# Altium project MB1144C.PrjPCB (part 1 of 4)
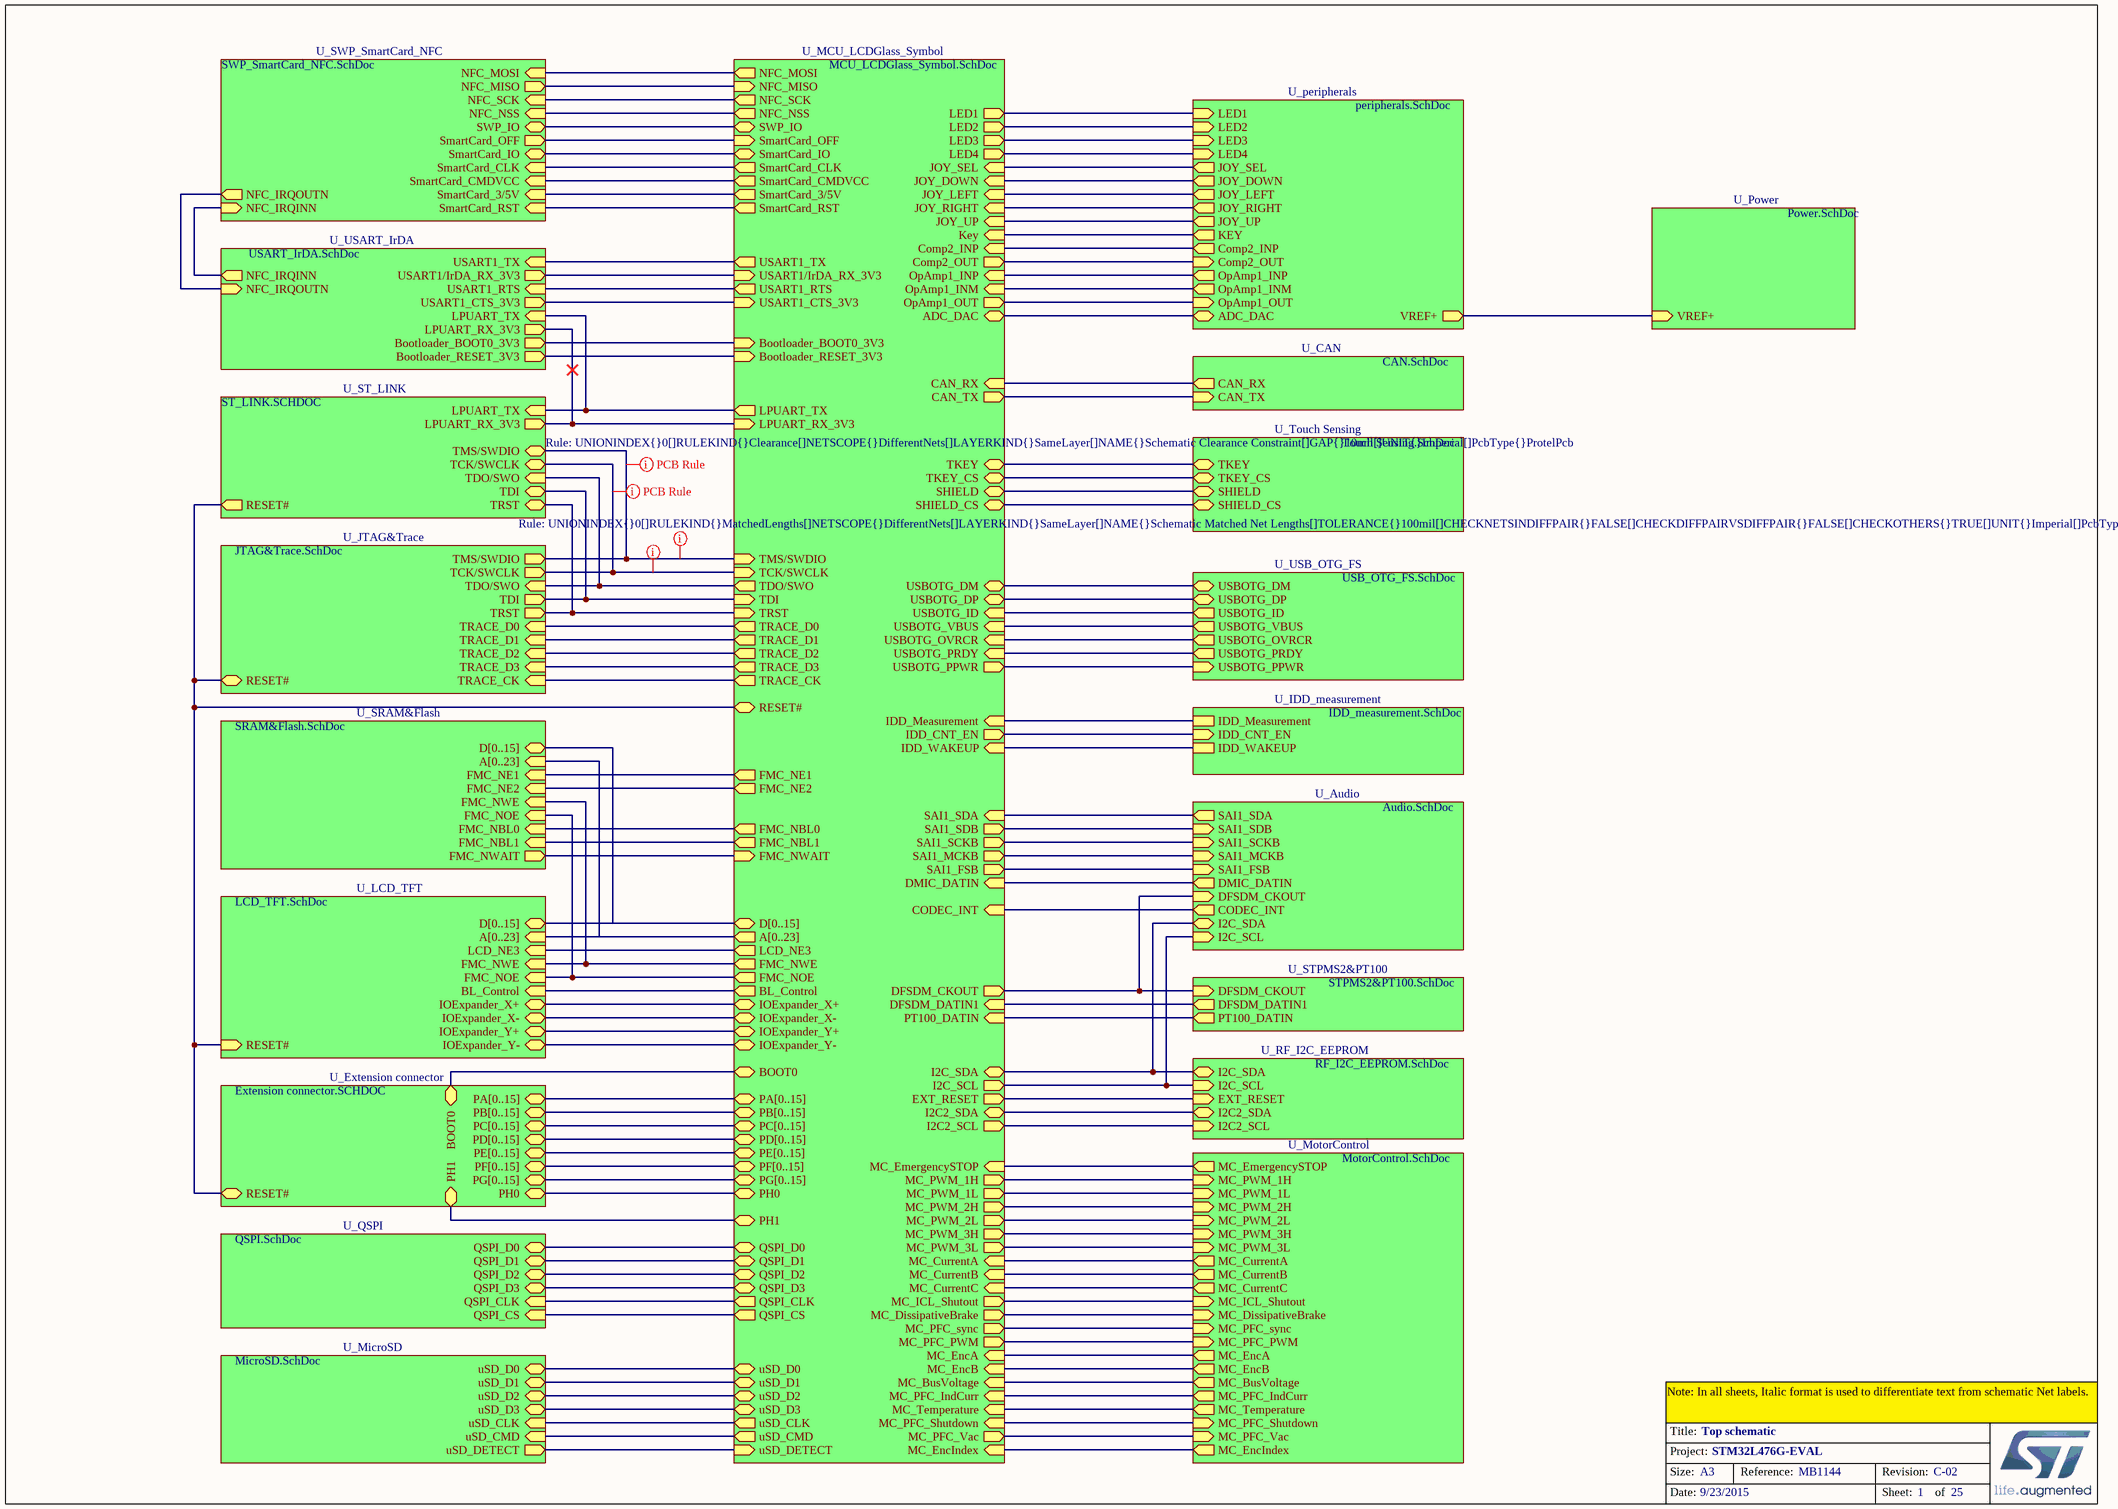
[diagram p0: Top.SchDoc]
25 sheets, 601 parts. Net scope: hierarchical (ports join the sheet entries above them; power ports are global).
Sheets:
  Top.SchDoc
    U_MCU_LCDGlass_Symbol = MCU_LCDGlass_Symbol.SchDoc
      U_MCU = MCU.SchDoc
      U_LCD_Glass = LCD_Glass.SchDoc
      U_IO_Expandor = IO_Expandor.SchDoc
      U_MCU2 = MCU2.SchDoc
    U_SRAM&Flash = SRAM&Flash.SchDoc
    U_MotorControl = MotorControl.SchDoc
    U_MicroSD = MicroSD.SchDoc
    U_QSPI = QSPI.SchDoc
    U_Extension connector = Extension connector.SCHDOC
    U_JTAG&Trace = JTAG&Trace.SchDoc
    U_ST_LINK = ST_LINK.SCHDOC
    U_USART_IrDA = USART_IrDA.SchDoc
    U_SWP_SmartCard_NFC = SWP_SmartCard_NFC.SchDoc
    U_STPMS2&PT100 = STPMS2&PT100.SchDoc
    U_IDD_measurement = IDD_measurement.SchDoc
    U_USB_OTG_FS = USB_OTG_FS.SchDoc
    U_Touch Sensing = Touch Sensing.SchDoc
    U_CAN = CAN.SchDoc
    U_peripherals = peripherals.SchDoc
    U_Power = Power.SchDoc
    U_Audio = Audio.SchDoc
    U_LCD_TFT = LCD_TFT.SchDoc
    U_RF_I2C_EEPROM = RF_I2C_EEPROM.SchDoc

## Sheet Top.SchDoc: Top schematic
size A3; DocumentNumber: MB1144; Revision: C-02; SheetNumber: 1; SheetTotal: 25; PageSetup: Record=PageOptions|CenterHorizontal=True|CenterVertical=True|PrintScale=1.01|XCorrection=1.00|YCorrection=1.00|PrintKind=1|BorderSize=5000000|LeftOffset=0|BottomOffset=0|Orientation=2|PaperLength=1000|PaperWidth=1000|Scale=100|PaperSource=264|PrintQuality=600|MediaType=1|DitherType=10|PaperKind=A3|PrintScaleMode=1; Project: STM32L476G-EVAL; DocumentName: STM32L476G-EVAL; ModifiedDate: 9/23/2015; ProjectName: STM32L476G-EVAL

### Sub-sheets
U_Audio = Audio.SchDoc: SAI1_SCKB (in), SAI1_FSB (in), SAI1_SDB (in), CODEC_INT (out), I2C_SCL (in), SAI1_MCKB (in), I2C_SDA (bidir), DMIC_DATIN (out), DFSDM_CKOUT (in), SAI1_SDA (out)
U_CAN = CAN.SchDoc: CAN_TX (in), CAN_RX (out)
U_Extension connector = Extension connector.SCHDOC: PA[0..15] (bidir), PB[0..15] (bidir), PC[0..15] (bidir), PD[0..15] (bidir), PE[0..15] (bidir), RESET# (bidir), PF[0..15] (bidir), PG[0..15] (bidir), PH1, PH0, BOOT0
U_IDD_measurement = IDD_measurement.SchDoc: IDD_Measurement, IDD_CNT_EN (in), IDD_WAKEUP
U_JTAG&Trace = JTAG&Trace.SchDoc: TDI (out), RESET# (bidir), TRACE_D3 (in), TRACE_D2 (in), TRACE_D1 (in), TRACE_D0 (in), TRACE_CK (in), TRST (out), TMS/SWDIO (out), TCK/SWCLK (out), TDO/SWO (in)
U_LCD_TFT = LCD_TFT.SchDoc: RESET# (in), FMC_NWE (in), LCD_NE3 (in), FMC_NOE (in), D[0..15] (bidir), A[0..23] (in), IOExpander_Y+ (bidir), IOExpander_Y- (bidir), IOExpander_X+ (bidir), IOExpander_X- (bidir), BL_Control (in)
U_MCU_LCDGlass_Symbol = MCU_LCDGlass_Symbol.SchDoc: FMC_NWAIT (in), FMC_NOE (out), FMC_NWE (out), FMC_NE1 (out), FMC_NE2 (out), LCD_NE3 (out), LED1 (out), LED2 (out), LPUART_TX (out), USART1_TX (out), USART1_RTS (out), TMS/SWDIO (in), TCK/SWCLK (in), TDI (in), TRST (in), Key (in), DFSDM_DATIN1 (in), IDD_Measurement (in), CODEC_INT (in), USBOTG_PRDY (in), USBOTG_OVRCR (in), DMIC_DATIN (in), PT100_DATIN (in), USBOTG_VBUS (in), USBOTG_ID (in), IDD_WAKEUP (in), OpAmp1_INM (in), Comp2_INP (in), TDO/SWO (out), TRACE_D1 (out), TRACE_D2 (out), TRACE_D3 (out), IDD_CNT_EN (out), USBOTG_PPWR (out), TRACE_CK (out), TRACE_D0 (out), SmartCard_CLK (out), OpAmp1_OUT (out), ADC_DAC (bidir), USBOTG_DP (bidir), USBOTG_DM (bidir), SmartCard_IO (bidir), QSPI_D0 (bidir), QSPI_D1 (bidir), QSPI_D2 (bidir), QSPI_D3 (bidir), uSD_D0 (bidir), uSD_D1 (bidir), uSD_D2 (bidir), uSD_D3 (bidir), MC_DissipativeBrake (out), MC_PFC_sync (out), MC_PWM_1H (out), MC_PWM_1L (out), MC_PWM_2H (out), MC_PWM_2L (out), MC_PWM_3H (out), MC_PWM_3L (out), MC_ICL_Shutout (out), MC_PFC_PWM (out), MC_PFC_Vac (out), QSPI_CLK (out), QSPI_CS (out), FMC_NBL0 (out), FMC_NBL1 (out), CAN_TX (out), MC_EncA (in), MC_EncB (in), MC_EncIndex (in), MC_CurrentB (in), MC_CurrentC (in), MC_Temperature (in), MC_PFC_Shutdown (in), CAN_RX (in), uSD_DETECT (in), uSD_CMD (out), uSD_CLK (out), SWP_IO (bidir), IOExpander_X+ (bidir), IOExpander_X- (bidir), IOExpander_Y+ (bidir), IOExpander_Y- (bidir), JOY_SEL (in), JOY_DOWN (in), JOY_LEFT (in), JOY_RIGHT (in), JOY_UP (in), SmartCard_OFF (in), LED4 (out), LED3 (out), SmartCard_RST (out), SmartCard_CMDVCC (out), SmartCard_3/5V (out), D[0..15] (bidir), A[0..23] (out), PA[0..15] (bidir), PB[0..15] (bidir), PC[0..15] (bidir), PD[0..15] (bidir), PE[0..15] (bidir), PF[0..15] (bidir), PG[0..15] (bidir), MC_CurrentA (in), MC_EmergencySTOP (in), MC_BusVoltage (in), MC_PFC_IndCurr (in), RESET# (bidir), DFSDM_CKOUT (out), I2C_SCL (out), I2C_SDA (bidir), PH1, PH0, SHIELD, SAI1_MCKB (out), SAI1_SCKB (out), SAI1_FSB (out), SAI1_SDB (out), SAI1_SDA (in), OpAmp1_INP (in), Comp2_OUT (out), TKEY, TKEY_CS, SHIELD_CS, Bootloader_RESET_3V3 (in), Bootloader_BOOT0_3V3 (in), LPUART_RX_3V3 (in), USART1_CTS_3V3 (in), USART1/IrDA_RX_3V3 (in), BL_Control (out), EXT_RESET (out), BOOT0, NFC_NSS (out), NFC_MOSI (out), NFC_SCK (out), NFC_MISO (in), I2C2_SDA (bidir), I2C2_SCL (out)
U_MicroSD = MicroSD.SchDoc: uSD_CLK (in), uSD_CMD (in), uSD_D0 (bidir), uSD_D1 (bidir), uSD_D2 (bidir), uSD_D3 (bidir), uSD_DETECT (out)
U_MotorControl = MotorControl.SchDoc: MC_EmergencySTOP (out), MC_CurrentA (out), MC_CurrentB (out), MC_CurrentC (out), MC_PFC_sync (in), MC_PWM_3L (in), MC_PWM_2H (in), MC_PWM_2L (in), MC_PWM_1H (in), MC_PWM_1L (in), MC_PWM_3H (in), MC_ICL_Shutout (in), MC_DissipativeBrake (in), MC_PFC_PWM (in), MC_EncA (out), MC_EncB (out), MC_BusVoltage (out), MC_EncIndex (out), MC_PFC_IndCurr (out), MC_Temperature (out), MC_PFC_Shutdown (in), MC_PFC_Vac (in)
U_peripherals = peripherals.SchDoc: ADC_DAC (bidir), LED4 (in), LED3 (in), LED1 (in), LED2 (in), JOY_SEL (out), JOY_DOWN (out), JOY_LEFT (out), JOY_RIGHT (out), JOY_UP (out), KEY (out), VREF+ (out), Comp2_INP (out), OpAmp1_OUT (in), OpAmp1_INM (out), OpAmp1_INP (out), Comp2_OUT (in)
U_Power = Power.SchDoc: VREF+ (in)
U_QSPI = QSPI.SchDoc: QSPI_D0 (bidir), QSPI_D3 (bidir), QSPI_D2 (bidir), QSPI_D1 (bidir), QSPI_CLK (in), QSPI_CS (in)
U_RF_I2C_EEPROM = RF_I2C_EEPROM.SchDoc: I2C_SCL (in), I2C_SDA (bidir), EXT_RESET (in), I2C2_SDA (bidir), I2C2_SCL (in)
U_SRAM&Flash = SRAM&Flash.SchDoc: FMC_NWE (in), FMC_NOE (in), FMC_NWAIT (out), FMC_NBL0 (in), FMC_NBL1 (in), D[0..15] (bidir), A[0..23] (in), FMC_NE1 (in), FMC_NE2 (in)
U_ST_LINK = ST_LINK.SCHDOC: TDO/SWO (in), RESET# (out), TDI, TRST, TMS/SWDIO, TCK/SWCLK, LPUART_RX_3V3 (out), LPUART_TX (in)
U_STPMS2&PT100 = STPMS2&PT100.SchDoc: DFSDM_CKOUT (in), DFSDM_DATIN1 (out), PT100_DATIN (out)
U_SWP_SmartCard_NFC = SWP_SmartCard_NFC.SchDoc: SWP_IO (bidir), SmartCard_3/5V (in), SmartCard_IO (bidir), SmartCard_RST (in), SmartCard_CLK (in), SmartCard_OFF (out), SmartCard_CMDVCC (in), NFC_IRQINN (in), NFC_IRQOUTN (out), NFC_NSS (in), NFC_MOSI (in), NFC_MISO (out), NFC_SCK (in)
U_Touch Sensing = Touch Sensing.SchDoc: SHIELD, SHIELD_CS, TKEY_CS, TKEY
U_USART_IrDA = USART_IrDA.SchDoc: USART1/IrDA_RX_3V3 (out), Bootloader_BOOT0_3V3 (out), Bootloader_RESET_3V3 (out), USART1_CTS_3V3 (out), USART1_TX (in), USART1_RTS (in), LPUART_RX_3V3 (out), LPUART_TX (in), NFC_IRQINN (out), NFC_IRQOUTN (in)
U_USB_OTG_FS = USB_OTG_FS.SchDoc: USBOTG_VBUS (out), USBOTG_PRDY (out), USBOTG_DM (bidir), USBOTG_DP (bidir), USBOTG_OVRCR (out), USBOTG_PPWR (in), USBOTG_ID (out)

### Nets
BOOT0: sheet U_MCU_LCDGlass_Symbol/BOOT0, sheet U_Extension connector/BOOT0
Comp2_INP: sheet U_MCU_LCDGlass_Symbol/Comp2_INP, sheet U_peripherals/Comp2_INP
Comp2_OUT: sheet U_MCU_LCDGlass_Symbol/Comp2_OUT, sheet U_peripherals/Comp2_OUT
I2C_SCL: sheet U_MCU_LCDGlass_Symbol/I2C_SCL, sheet U_Audio/I2C_SCL, sheet U_RF_I2C_EEPROM/I2C_SCL
I2C_SDA: sheet U_MCU_LCDGlass_Symbol/I2C_SDA, sheet U_Audio/I2C_SDA, sheet U_RF_I2C_EEPROM/I2C_SDA
LCD_NE3: sheet U_MCU_LCDGlass_Symbol/LCD_NE3, sheet U_LCD_TFT/LCD_NE3
LCDSEG7: sheet U_MCU_LCDGlass_Symbol/TDO/SWO, sheet U_JTAG&Trace/TDO/SWO, sheet U_ST_LINK/TDO/SWO
LCDSEG8: sheet U_MCU_LCDGlass_Symbol/TRST, sheet U_JTAG&Trace/TRST, sheet U_ST_LINK/TRST
LCDSEG17: sheet U_MCU_LCDGlass_Symbol/TDI, sheet U_JTAG&Trace/TDI, sheet U_ST_LINK/TDI
OpAmp1_INM: sheet U_MCU_LCDGlass_Symbol/OpAmp1_INM, sheet U_peripherals/OpAmp1_INM
OpAmp1_INP: sheet U_MCU_LCDGlass_Symbol/OpAmp1_INP, sheet U_peripherals/OpAmp1_INP
OpAmp1_OUT: sheet U_MCU_LCDGlass_Symbol/OpAmp1_OUT, sheet U_peripherals/OpAmp1_OUT
PA4: sheet U_MCU_LCDGlass_Symbol/ADC_DAC, sheet U_peripherals/ADC_DAC
PA11: sheet U_MCU_LCDGlass_Symbol/USBOTG_DM, sheet U_USB_OTG_FS/USBOTG_DM
PA12: sheet U_MCU_LCDGlass_Symbol/USBOTG_DP, sheet U_USB_OTG_FS/USBOTG_DP
PA13: sheet U_MCU_LCDGlass_Symbol/TMS/SWDIO, sheet U_JTAG&Trace/TMS/SWDIO, sheet U_ST_LINK/TMS/SWDIO
PA14: sheet U_MCU_LCDGlass_Symbol/TCK/SWCLK, sheet U_JTAG&Trace/TCK/SWCLK, sheet U_ST_LINK/TCK/SWCLK
PB6: sheet U_MCU_LCDGlass_Symbol/USART1_TX, sheet U_USART_IrDA/USART1_TX
PC13: sheet U_MCU_LCDGlass_Symbol/Key, sheet U_peripherals/KEY
PD3: sheet U_MCU_LCDGlass_Symbol/DFSDM_DATIN1, sheet U_STPMS2&PT100/DFSDM_DATIN1
PD4: sheet U_MCU_LCDGlass_Symbol/FMC_NOE, sheet U_SRAM&Flash/FMC_NOE, sheet U_LCD_TFT/FMC_NOE
PD5: sheet U_MCU_LCDGlass_Symbol/FMC_NWE, sheet U_SRAM&Flash/FMC_NWE, sheet U_LCD_TFT/FMC_NWE
PD7: sheet U_MCU_LCDGlass_Symbol/FMC_NE1, sheet U_SRAM&Flash/FMC_NE1
PF11: sheet U_MCU_LCDGlass_Symbol/NFC_NSS, sheet U_SWP_SmartCard_NFC/NFC_NSS
PG8: sheet U_MCU_LCDGlass_Symbol/LPUART_RX_3V3, sheet U_ST_LINK/LPUART_RX_3V3, sheet U_USART_IrDA/LPUART_RX_3V3
PG9: sheet U_MCU_LCDGlass_Symbol/FMC_NE2, sheet U_SRAM&Flash/FMC_NE2
PG11: sheet U_MCU_LCDGlass_Symbol/USART1_CTS_3V3, sheet U_USART_IrDA/USART1_CTS_3V3
PG12: sheet U_MCU_LCDGlass_Symbol/USART1_RTS, sheet U_USART_IrDA/USART1_RTS
PH0: sheet U_MCU_LCDGlass_Symbol/PH0, sheet U_Extension connector/PH0
PH1: sheet U_MCU_LCDGlass_Symbol/PH1, sheet U_Extension connector/PH1
RESET#: sheet U_MCU_LCDGlass_Symbol/RESET#, sheet U_Extension connector/RESET#, sheet U_JTAG&Trace/RESET#, sheet U_ST_LINK/RESET#, sheet U_LCD_TFT/RESET#
NetB3_1: sheet U_MCU_LCDGlass_Symbol/JOY_LEFT, sheet U_peripherals/JOY_LEFT
NetB3_2: sheet U_MCU_LCDGlass_Symbol/JOY_SEL, sheet U_peripherals/JOY_SEL
NetB3_3: sheet U_MCU_LCDGlass_Symbol/JOY_DOWN, sheet U_peripherals/JOY_DOWN
NetB3_4: sheet U_MCU_LCDGlass_Symbol/JOY_RIGHT, sheet U_peripherals/JOY_RIGHT
NetB3_6: sheet U_MCU_LCDGlass_Symbol/JOY_UP, sheet U_peripherals/JOY_UP
NetC1_2: sheet U_MCU_LCDGlass_Symbol/MC_EncB, sheet U_MotorControl/MC_EncB
NetC2_2: sheet U_MCU_LCDGlass_Symbol/MC_EncIndex, sheet U_MotorControl/MC_EncIndex
NetC3_1: sheet U_MCU_LCDGlass_Symbol/MC_PFC_IndCurr, sheet U_MotorControl/MC_PFC_IndCurr
NetC4_2: sheet U_MCU_LCDGlass_Symbol/MC_EncA, sheet U_MotorControl/MC_EncA
NetC5_2: sheet U_MCU_LCDGlass_Symbol/MC_PFC_Shutdown, sheet U_MotorControl/MC_PFC_Shutdown
NetC6_2: sheet U_MCU_LCDGlass_Symbol/MC_PFC_Vac, sheet U_MotorControl/MC_PFC_Vac
NetC7_2: sheet U_MCU_LCDGlass_Symbol/MC_EmergencySTOP, sheet U_MotorControl/MC_EmergencySTOP
NetC9_2: sheet U_MCU_LCDGlass_Symbol/MC_PFC_PWM, sheet U_MotorControl/MC_PFC_PWM
NetC10_2: sheet U_MCU_LCDGlass_Symbol/MC_CurrentC, sheet U_MotorControl/MC_CurrentC
NetC11_1: sheet U_MCU_LCDGlass_Symbol/MC_BusVoltage, sheet U_MotorControl/MC_BusVoltage
NetC13_2: sheet U_MCU_LCDGlass_Symbol/MC_CurrentB, sheet U_MotorControl/MC_CurrentB
NetC14_2: sheet U_MCU_LCDGlass_Symbol/MC_CurrentA, sheet U_MotorControl/MC_CurrentA
NetC15_1: sheet U_MCU_LCDGlass_Symbol/USBOTG_PRDY, sheet U_MCU_LCDGlass_Symbol/USBOTG_VBUS, sheet U_USB_OTG_FS/USBOTG_VBUS, sheet U_USB_OTG_FS/USBOTG_PRDY
NetC16_2: sheet U_MCU_LCDGlass_Symbol/MC_PFC_sync, sheet U_MotorControl/MC_PFC_sync
NetC17_1: sheet U_MCU_LCDGlass_Symbol/MC_Temperature, sheet U_MotorControl/MC_Temperature
NetC34_2: sheet U_MCU_LCDGlass_Symbol/SHIELD_CS, sheet U_Touch Sensing/SHIELD_CS
NetC37_2: sheet U_MCU_LCDGlass_Symbol/TKEY_CS, sheet U_Touch Sensing/TKEY_CS
NetC52_2: sheet U_peripherals/VREF+, sheet U_Power/VREF+
NetC73_1: sheet U_MCU_LCDGlass_Symbol/IDD_Measurement, sheet U_IDD_measurement/IDD_Measurement
NetCN2_3: sheet U_MCU_LCDGlass_Symbol/MC_PWM_1H, sheet U_MotorControl/MC_PWM_1H
NetCN2_5: sheet U_MCU_LCDGlass_Symbol/MC_PWM_1L, sheet U_MotorControl/MC_PWM_1L
NetCN2_7: sheet U_MCU_LCDGlass_Symbol/MC_PWM_2H, sheet U_MotorControl/MC_PWM_2H
NetCN2_9: sheet U_MCU_LCDGlass_Symbol/MC_PWM_2L, sheet U_MotorControl/MC_PWM_2L
NetCN2_11: sheet U_MCU_LCDGlass_Symbol/MC_PWM_3H, sheet U_MotorControl/MC_PWM_3H
NetCN2_13: sheet U_MCU_LCDGlass_Symbol/MC_PWM_3L, sheet U_MotorControl/MC_PWM_3L
NetCN2_21: sheet U_MCU_LCDGlass_Symbol/MC_ICL_Shutout, sheet U_MotorControl/MC_ICL_Shutout
NetCN2_23: sheet U_MCU_LCDGlass_Symbol/MC_DissipativeBrake, sheet U_MotorControl/MC_DissipativeBrake
NetCN3_4: sheet U_MCU_LCDGlass_Symbol/EXT_RESET, sheet U_RF_I2C_EEPROM/EXT_RESET
NetCN11_4: sheet U_MCU_LCDGlass_Symbol/uSD_DETECT, sheet U_MicroSD/uSD_DETECT
NetCN11_6: sheet U_MCU_LCDGlass_Symbol/USBOTG_ID, sheet U_USB_OTG_FS/USBOTG_ID
NetCN11_8: sheet U_MCU_LCDGlass_Symbol/CAN_TX, sheet U_CAN/CAN_TX
NetCN11_16: sheet U_MCU_LCDGlass_Symbol/NFC_MISO, sheet U_SWP_SmartCard_NFC/NFC_MISO
NetCN11_18: sheet U_MCU_LCDGlass_Symbol/NFC_SCK, sheet U_SWP_SmartCard_NFC/NFC_SCK
NetCN11_20: sheet U_MCU_LCDGlass_Symbol/SWP_IO, sheet U_SWP_SmartCard_NFC/SWP_IO
NetCN11_24: sheet U_MCU_LCDGlass_Symbol/CAN_RX, sheet U_CAN/CAN_RX
NetCN11_26: sheet U_MCU_LCDGlass_Symbol/NFC_MOSI, sheet U_SWP_SmartCard_NFC/NFC_MOSI
NetCN11_28: sheet U_MCU_LCDGlass_Symbol/DFSDM_CKOUT, sheet U_STPMS2&PT100/DFSDM_CKOUT, sheet U_Audio/DFSDM_CKOUT
NetCN11_30: sheet U_MCU_LCDGlass_Symbol/LED3, sheet U_peripherals/LED3
NetCN11_32: sheet U_MCU_LCDGlass_Symbol/DMIC_DATIN, sheet U_Audio/DMIC_DATIN
NetCN12_12: sheet U_MCU_LCDGlass_Symbol/TRACE_CK, sheet U_JTAG&Trace/TRACE_CK
NetCN12_18: sheet U_MCU_LCDGlass_Symbol/TRACE_D2, sheet U_JTAG&Trace/TRACE_D2
NetCN12_20: sheet U_MCU_LCDGlass_Symbol/TRACE_D3, sheet U_JTAG&Trace/TRACE_D3
NetCN13_1: sheet U_USART_IrDA/NFC_IRQOUTN, sheet U_SWP_SmartCard_NFC/NFC_IRQOUTN
NetCN13_2: sheet U_USART_IrDA/NFC_IRQINN, sheet U_SWP_SmartCard_NFC/NFC_IRQINN
NetCN14_2: sheet U_MCU_LCDGlass_Symbol/uSD_CMD, sheet U_MicroSD/uSD_CMD
NetCN14_10: sheet U_MCU_LCDGlass_Symbol/USART1/IrDA_RX_3V3, sheet U_USART_IrDA/USART1/IrDA_RX_3V3
NetCN14_40: sheet U_MCU_LCDGlass_Symbol/FMC_NBL0, sheet U_SRAM&Flash/FMC_NBL0
NetCN14_42: sheet U_MCU_LCDGlass_Symbol/FMC_NBL1, sheet U_SRAM&Flash/FMC_NBL1
NetCN18_1: sheet U_MCU_LCDGlass_Symbol/uSD_D2, sheet U_MicroSD/uSD_D2
NetCN18_2: sheet U_MCU_LCDGlass_Symbol/uSD_D3, sheet U_MicroSD/uSD_D3
NetCN18_5: sheet U_MCU_LCDGlass_Symbol/uSD_CLK, sheet U_MicroSD/uSD_CLK
NetCN18_7: sheet U_MCU_LCDGlass_Symbol/uSD_D0, sheet U_MicroSD/uSD_D0
NetCN18_8: sheet U_MCU_LCDGlass_Symbol/uSD_D1, sheet U_MicroSD/uSD_D1
NetCN19_31: sheet U_MCU_LCDGlass_Symbol/IOExpander_X-, sheet U_LCD_TFT/IOExpander_X-
NetCN19_32: sheet U_MCU_LCDGlass_Symbol/IOExpander_X+, sheet U_LCD_TFT/IOExpander_X+
NetCN19_33: sheet U_MCU_LCDGlass_Symbol/IOExpander_Y-, sheet U_LCD_TFT/IOExpander_Y-
NetCN19_34: sheet U_MCU_LCDGlass_Symbol/IOExpander_Y+, sheet U_LCD_TFT/IOExpander_Y+
NetD4_2: sheet U_MCU_LCDGlass_Symbol/Bootloader_RESET_3V3, sheet U_USART_IrDA/Bootloader_RESET_3V3
NetJP19_1: sheet U_MCU_LCDGlass_Symbol/USBOTG_PPWR, sheet U_USB_OTG_FS/USBOTG_PPWR
NetLD6_2: sheet U_MCU_LCDGlass_Symbol/USBOTG_OVRCR, sheet U_USB_OTG_FS/USBOTG_OVRCR
NetR24_1: sheet U_MCU_LCDGlass_Symbol/PT100_DATIN, sheet U_STPMS2&PT100/PT100_DATIN
NetR32_2: sheet U_MCU_LCDGlass_Symbol/FMC_NWAIT, sheet U_SRAM&Flash/FMC_NWAIT
NetR34_1: sheet U_MCU_LCDGlass_Symbol/LPUART_TX, sheet U_ST_LINK/LPUART_TX, sheet U_USART_IrDA/LPUART_TX
NetR35_1: sheet U_MCU_LCDGlass_Symbol/CODEC_INT, sheet U_Audio/CODEC_INT
NetR37_1: sheet U_MCU_LCDGlass_Symbol/SHIELD, sheet U_Touch Sensing/SHIELD
NetR39_1: sheet U_MCU_LCDGlass_Symbol/TKEY, sheet U_Touch Sensing/TKEY
NetR53_2: sheet U_MCU_LCDGlass_Symbol/SAI1_SDA, sheet U_Audio/SAI1_SDA
NetR54_2: sheet U_MCU_LCDGlass_Symbol/LED1, sheet U_peripherals/LED1
NetR59_2: sheet U_MCU_LCDGlass_Symbol/Bootloader_BOOT0_3V3, sheet U_USART_IrDA/Bootloader_BOOT0_3V3
NetR71_2: sheet U_MCU_LCDGlass_Symbol/QSPI_CS, sheet U_QSPI/QSPI_CS
NetR89_1: sheet U_MCU_LCDGlass_Symbol/SAI1_SCKB, sheet U_Audio/SAI1_SCKB
NetR90_1: sheet U_MCU_LCDGlass_Symbol/SAI1_FSB, sheet U_Audio/SAI1_FSB
NetR91_1: sheet U_MCU_LCDGlass_Symbol/IDD_CNT_EN, sheet U_IDD_measurement/IDD_CNT_EN
NetR104_1: sheet U_MCU_LCDGlass_Symbol/TRACE_D0, sheet U_JTAG&Trace/TRACE_D0
NetR105_1: sheet U_MCU_LCDGlass_Symbol/SAI1_SDB, sheet U_Audio/SAI1_SDB
NetR106_1: sheet U_MCU_LCDGlass_Symbol/SAI1_MCKB, sheet U_Audio/SAI1_MCKB
NetR107_1: sheet U_MCU_LCDGlass_Symbol/SmartCard_CLK, sheet U_SWP_SmartCard_NFC/SmartCard_CLK
NetR137_1: sheet U_MCU_LCDGlass_Symbol/IDD_WAKEUP, sheet U_IDD_measurement/IDD_WAKEUP
NetR143_1: sheet U_MCU_LCDGlass_Symbol/SmartCard_IO, sheet U_SWP_SmartCard_NFC/SmartCard_IO
NetR156_2: sheet U_MCU_LCDGlass_Symbol/TRACE_D1, sheet U_JTAG&Trace/TRACE_D1
NetR213_1: sheet U_MCU_LCDGlass_Symbol/SmartCard_OFF, sheet U_SWP_SmartCard_NFC/SmartCard_OFF
NetR214_2: sheet U_MCU_LCDGlass_Symbol/SmartCard_RST, sheet U_SWP_SmartCard_NFC/SmartCard_RST
NetR215_2: sheet U_MCU_LCDGlass_Symbol/SmartCard_CMDVCC, sheet U_SWP_SmartCard_NFC/SmartCard_CMDVCC
NetR241_1: sheet U_MCU_LCDGlass_Symbol/SmartCard_3/5V, sheet U_SWP_SmartCard_NFC/SmartCard_3/5V
NetR255_1: sheet U_MCU_LCDGlass_Symbol/LED4, sheet U_peripherals/LED4
NetR257_1: sheet U_MCU_LCDGlass_Symbol/LED2, sheet U_peripherals/LED2
NetR260_1: sheet U_MCU_LCDGlass_Symbol/BL_Control, sheet U_LCD_TFT/BL_Control
NetR263_2: sheet U_MCU_LCDGlass_Symbol/I2C2_SDA, sheet U_RF_I2C_EEPROM/I2C2_SDA
NetR264_2: sheet U_MCU_LCDGlass_Symbol/I2C2_SCL, sheet U_RF_I2C_EEPROM/I2C2_SCL
NetSB9_1: sheet U_MCU_LCDGlass_Symbol/QSPI_CLK, sheet U_QSPI/QSPI_CLK
NetSB12_1: sheet U_MCU_LCDGlass_Symbol/QSPI_D0, sheet U_QSPI/QSPI_D0
NetSB14_1: sheet U_MCU_LCDGlass_Symbol/QSPI_D1, sheet U_QSPI/QSPI_D1
NetSB18_1: sheet U_MCU_LCDGlass_Symbol/QSPI_D2, sheet U_QSPI/QSPI_D2
NetSB21_1: sheet U_MCU_LCDGlass_Symbol/QSPI_D3, sheet U_QSPI/QSPI_D3

### Buses and harness runs
bus sheet U_Extension connector/PA[0..15] = sheet U_MCU_LCDGlass_Symbol/PA[0..15]
bus sheet U_Extension connector/PB[0..15] = sheet U_MCU_LCDGlass_Symbol/PB[0..15]
bus sheet U_Extension connector/PC[0..15] = sheet U_MCU_LCDGlass_Symbol/PC[0..15]
bus sheet U_Extension connector/PD[0..15] = sheet U_MCU_LCDGlass_Symbol/PD[0..15]
bus sheet U_Extension connector/PE[0..15] = sheet U_MCU_LCDGlass_Symbol/PE[0..15]
bus sheet U_Extension connector/PF[0..15] = sheet U_MCU_LCDGlass_Symbol/PF[0..15]
bus sheet U_Extension connector/PG[0..15] = sheet U_MCU_LCDGlass_Symbol/PG[0..15]
bus sheet U_LCD_TFT/A[0..23] = sheet U_MCU_LCDGlass_Symbol/A[0..23] = sheet U_SRAM&Flash/A[0..23]
bus sheet U_LCD_TFT/D[0..15] = sheet U_MCU_LCDGlass_Symbol/D[0..15] = sheet U_SRAM&Flash/D[0..15]

### Layout directives
rule Matched Net Lengths [Tolerance = 100mil]: PA13, PA14
rule Clearance Constraint [Clearance = 10mil]: PA13, PA14

### Notes on the sheet
- Note: In all sheets, Italic format is used to differentiate text from schematic Net labels.
- Title:
- Project:
- Size:
- Date:
- A3
- Reference:
- Sheet:
- Revision:
- of

## Sheet MCU_LCDGlass_Symbol.SchDoc: MCU_LCDGlassl
size A3; DocumentNumber: MB1144; Revision: C-02; SheetNumber: 2; SheetTotal: 25; PageSetup: Record=PageOptions|CenterHorizontal=True|CenterVertical=True|PrintScale=1.01|XCorrection=1.00|YCorrection=1.00|PrintKind=1|BorderSize=5000000|LeftOffset=0|BottomOffset=0|Orientation=2|PaperLength=1000|PaperWidth=1000|Scale=100|PaperSource=264|PrintQuality=600|MediaType=1|DitherType=10|PaperKind=A3|PrintScaleMode=1; Project: STM32L476G-EVAL; ModifiedDate: 9/23/2015
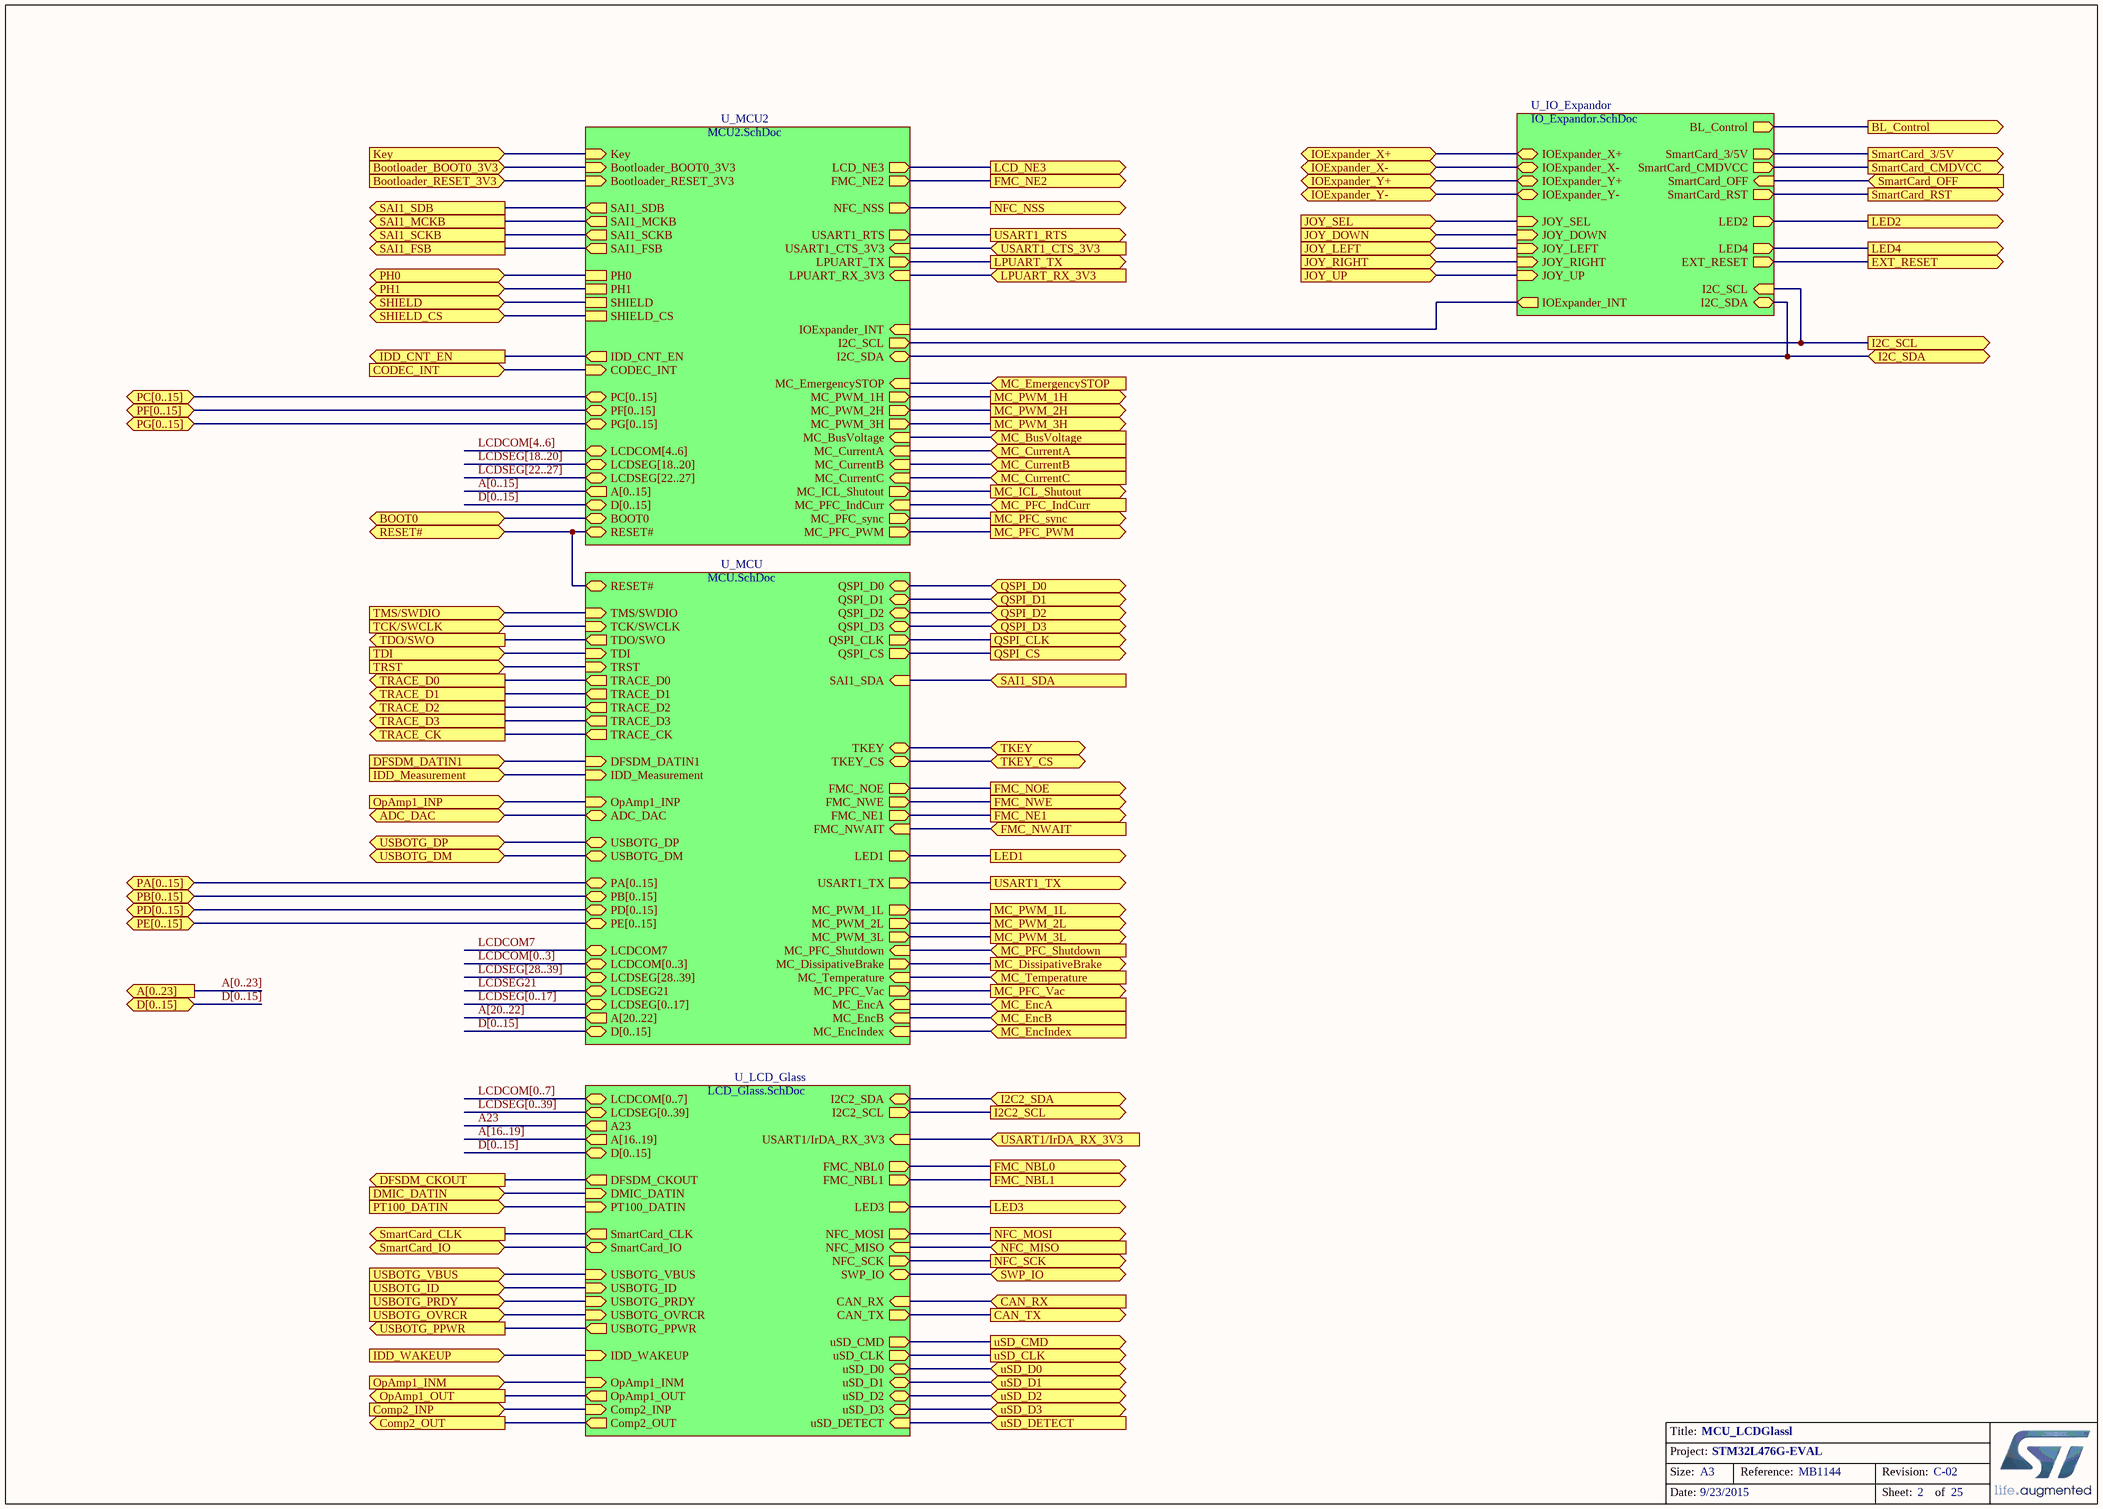
[diagram p1: MCU_LCDGlass_Symbol.SchDoc]

### Sub-sheets
U_IO_Expandor = IO_Expandor.SchDoc: IOExpander_Y+ (bidir), IOExpander_Y- (bidir), IOExpander_X+ (bidir), IOExpander_X- (bidir), IOExpander_INT (out), I2C_SDA (bidir), JOY_SEL (in), JOY_DOWN (in), JOY_LEFT (in), JOY_RIGHT (in), JOY_UP (in), LED4 (out), SmartCard_RST (out), SmartCard_CMDVCC (out), SmartCard_3/5V (out), SmartCard_OFF (in), I2C_SCL (in), LED2 (out), BL_Control (out), EXT_RESET (out)
U_LCD_Glass = LCD_Glass.SchDoc: uSD_CMD (out), uSD_CLK (out), uSD_D3 (bidir), uSD_D2 (bidir), IDD_WAKEUP (in), PT100_DATIN (in), uSD_D0 (bidir), uSD_D1 (bidir), OpAmp1_INM (in), FMC_NBL0 (out), FMC_NBL1 (out), LCDSEG[0..39] (bidir), LCDCOM[0..7] (bidir), USBOTG_VBUS (in), USBOTG_ID (in), CAN_TX (out), SWP_IO (bidir), CAN_RX (in), DMIC_DATIN (in), OpAmp1_OUT (out), Comp2_INP (in), SmartCard_CLK (out), SmartCard_IO (bidir), uSD_DETECT (in), DFSDM_CKOUT (out), D[0..15] (bidir), USBOTG_PRDY (in), USBOTG_OVRCR (in), USBOTG_PPWR (out), Comp2_OUT (out), USART1/IrDA_RX_3V3 (in), A[16..19] (out), A23 (out), NFC_MISO (in), NFC_SCK (out), NFC_MOSI (out), I2C2_SDA (bidir), I2C2_SCL (out), LED3 (out)
U_MCU = MCU.SchDoc: PA[0..15] (bidir), PB[0..15] (bidir), PD[0..15] (bidir), PE[0..15] (bidir), USBOTG_DM (bidir), USBOTG_DP (bidir), TMS/SWDIO (in), TCK/SWCLK (in), DFSDM_DATIN1 (in), FMC_NOE (out), FMC_NWE (out), FMC_NWAIT (in), FMC_NE1 (out), TRACE_D3 (out), TRACE_D1 (out), TRST (in), D[0..15] (bidir), IDD_Measurement (in), USART1_TX (out), LED1 (out), MC_DissipativeBrake (out), TRACE_D2 (out), MC_EncA (in), TDI (in), TDO/SWO (out), ADC_DAC (bidir), RESET# (bidir), QSPI_D3 (bidir), QSPI_D2 (bidir), QSPI_D1 (bidir), QSPI_D0 (bidir), QSPI_CLK (out), QSPI_CS (out), TRACE_D0 (out), TRACE_CK (out), SAI1_SDA (in), OpAmp1_INP (in), MC_PFC_Vac (out), MC_Temperature (in), MC_EncB (in), MC_EncIndex (in), TKEY, TKEY_CS, MC_PWM_1L (out), MC_PWM_2L (out), MC_PWM_3L (out), MC_PFC_Shutdown (in), A[20..22] (out), LCDCOM[0..3] (bidir), LCDCOM7, LCDSEG[0..17] (bidir), LCDSEG[28..39] (bidir), LCDSEG21 (bidir)
U_MCU2 = MCU2.SchDoc: PC[0..15] (bidir), Bootloader_BOOT0_3V3 (in), Bootloader_RESET_3V3 (in), Key (in), CODEC_INT (in), USART1_CTS_3V3 (in), FMC_NE2 (out), USART1_RTS (out), PF[0..15] (bidir), PG[0..15] (bidir), D[0..15] (bidir), MC_PFC_sync (out), IDD_CNT_EN (out), LPUART_TX (out), LPUART_RX_3V3 (in), LCD_NE3 (out), IOExpander_INT (in), I2C_SCL (out), I2C_SDA (bidir), RESET# (bidir), PH1, PH0, SHIELD, SAI1_SDB (out), SAI1_MCKB (out), SAI1_SCKB (out), SAI1_FSB (out), MC_ICL_Shutout (out), MC_PFC_PWM (out), MC_CurrentB (in), MC_CurrentC (in), MC_CurrentA (in), MC_PFC_IndCurr (in), MC_BusVoltage (in), MC_PWM_1H (out), SHIELD_CS, MC_PWM_2H (out), MC_PWM_3H (out), MC_EmergencySTOP (in), A[0..15] (out), LCDSEG[18..20] (bidir), LCDCOM[4..6] (bidir), LCDSEG[22..27] (bidir), BOOT0, NFC_NSS (out)

### Ports
A[0..23] (out), ADC_DAC (bidir), BL_Control (out), BOOT0, Bootloader_BOOT0_3V3 (in), Bootloader_RESET_3V3 (in), CAN_RX (in), CAN_TX (out), CODEC_INT (in), Comp2_INP (in), Comp2_OUT (out), D[0..15] (bidir), DFSDM_CKOUT (out), DFSDM_DATIN1 (in), DMIC_DATIN (in), EXT_RESET (out), FMC_NBL0 (out), FMC_NBL1 (out), FMC_NE1 (out), FMC_NE2 (out), FMC_NOE (out), FMC_NWAIT (in), FMC_NWE (out), I2C2_SCL (out), I2C2_SDA (bidir), I2C_SCL (out), I2C_SDA (bidir), IDD_CNT_EN (out), IDD_Measurement (in), IDD_WAKEUP (in), IOExpander_X+ (bidir), IOExpander_X- (bidir), IOExpander_Y+ (bidir), IOExpander_Y- (bidir), JOY_DOWN (in), JOY_LEFT (in), JOY_RIGHT (in), JOY_SEL (in), JOY_UP (in), Key (in), LCD_NE3 (out), LED1 (out), LED2 (out), LED3 (out), LED4 (out), LPUART_RX_3V3 (in), LPUART_TX (out), MC_BusVoltage (in), MC_CurrentA (in), MC_CurrentB (in), MC_CurrentC (in), MC_DissipativeBrake (out), MC_EmergencySTOP (in), MC_EncA (in), MC_EncB (in), MC_EncIndex (in), MC_ICL_Shutout (out), MC_PFC_IndCurr (in), MC_PFC_PWM (out), MC_PFC_Shutdown (in), MC_PFC_sync (out), MC_PFC_Vac (out), MC_PWM_1H (out), MC_PWM_1L (out), MC_PWM_2H (out), MC_PWM_2L (out), MC_PWM_3H (out), MC_PWM_3L (out), MC_Temperature (in), NFC_MISO (in), NFC_MOSI (out), NFC_NSS (out), NFC_SCK (out), OpAmp1_INM (in), OpAmp1_INP (in), OpAmp1_OUT (out), PA[0..15] (bidir), PB[0..15] (bidir), PC[0..15] (bidir), PD[0..15] (bidir), PE[0..15] (bidir), PF[0..15] (bidir), PG[0..15] (bidir), PH0, PH1, PT100_DATIN (in), QSPI_CLK (out), QSPI_CS (out), QSPI_D0 (bidir), QSPI_D1 (bidir), QSPI_D2 (bidir), QSPI_D3 (bidir), RESET# (bidir), SAI1_FSB (out), SAI1_MCKB (out), SAI1_SCKB (out), SAI1_SDA (in), SAI1_SDB (out), SHIELD, SHIELD_CS, SmartCard_3/5V (out), SmartCard_CLK (out), SmartCard_CMDVCC (out), SmartCard_IO (bidir), SmartCard_OFF (in), SmartCard_RST (out), SWP_IO (bidir), TCK/SWCLK (in), TDI (in), TDO/SWO (out), TKEY, TKEY_CS, TMS/SWDIO (in), TRACE_CK (out), TRACE_D0 (out), TRACE_D1 (out), TRACE_D2 (out), TRACE_D3 (out), TRST (in), USART1/IrDA_RX_3V3 (in), USART1_CTS_3V3 (in), USART1_RTS (out), USART1_TX (out), USBOTG_DM (bidir), USBOTG_DP (bidir), USBOTG_ID (in), USBOTG_OVRCR (in), USBOTG_PPWR (out), USBOTG_PRDY (in), USBOTG_VBUS (in), uSD_CLK (out), uSD_CMD (out), uSD_D0 (bidir), uSD_D1 (bidir), uSD_D2 (bidir), uSD_D3 (bidir), uSD_DETECT (in)

### Nets
BOOT0: port BOOT0, sheet U_MCU2/BOOT0
Comp2_INP: port Comp2_INP, sheet U_LCD_Glass/Comp2_INP
Comp2_OUT: port Comp2_OUT, sheet U_LCD_Glass/Comp2_OUT
I2C_SCL: port I2C_SCL, sheet U_IO_Expandor/I2C_SCL, sheet U_MCU2/I2C_SCL
I2C_SDA: port I2C_SDA, sheet U_IO_Expandor/I2C_SDA, sheet U_MCU2/I2C_SDA
LCD_NE3: port LCD_NE3, sheet U_MCU2/LCD_NE3
LCDSEG7: port TDO/SWO, sheet U_MCU/TDO/SWO
LCDSEG8: port TRST, sheet U_MCU/TRST
LCDSEG17: port TDI, sheet U_MCU/TDI
OpAmp1_INM: port OpAmp1_INM, sheet U_LCD_Glass/OpAmp1_INM
OpAmp1_INP: port OpAmp1_INP, sheet U_MCU/OpAmp1_INP
OpAmp1_OUT: port OpAmp1_OUT, sheet U_LCD_Glass/OpAmp1_OUT
PA4: port ADC_DAC, sheet U_MCU/ADC_DAC
PA11: port USBOTG_DM, sheet U_MCU/USBOTG_DM
PA12: port USBOTG_DP, sheet U_MCU/USBOTG_DP
PA13: port TMS/SWDIO, sheet U_MCU/TMS/SWDIO
PA14: port TCK/SWCLK, sheet U_MCU/TCK/SWCLK
PB6: port USART1_TX, sheet U_MCU/USART1_TX
PC13: port Key, sheet U_MCU2/Key
PD3: port DFSDM_DATIN1, sheet U_MCU/DFSDM_DATIN1
PD4: port FMC_NOE, sheet U_MCU/FMC_NOE
PD5: port FMC_NWE, sheet U_MCU/FMC_NWE
PD7: port FMC_NE1, sheet U_MCU/FMC_NE1
PF11: port NFC_NSS, sheet U_MCU2/NFC_NSS
PG8: port LPUART_RX_3V3, sheet U_MCU2/LPUART_RX_3V3
PG9: port FMC_NE2, sheet U_MCU2/FMC_NE2
PG11: port USART1_CTS_3V3, sheet U_MCU2/USART1_CTS_3V3
PG12: port USART1_RTS, sheet U_MCU2/USART1_RTS
PG15: sheet U_IO_Expandor/IOExpander_INT, sheet U_MCU2/IOExpander_INT
PH0: port PH0, sheet U_MCU2/PH0
PH1: port PH1, sheet U_MCU2/PH1
RESET#: port RESET#, sheet U_MCU/RESET#, sheet U_MCU2/RESET#
NetB3_1: port JOY_LEFT, sheet U_IO_Expandor/JOY_LEFT
NetB3_2: port JOY_SEL, sheet U_IO_Expandor/JOY_SEL
NetB3_3: port JOY_DOWN, sheet U_IO_Expandor/JOY_DOWN
NetB3_4: port JOY_RIGHT, sheet U_IO_Expandor/JOY_RIGHT
NetB3_6: port JOY_UP, sheet U_IO_Expandor/JOY_UP
NetC1_2: port MC_EncB, sheet U_MCU/MC_EncB
NetC2_2: port MC_EncIndex, sheet U_MCU/MC_EncIndex
NetC3_1: port MC_PFC_IndCurr, sheet U_MCU2/MC_PFC_IndCurr
NetC4_2: port MC_EncA, sheet U_MCU/MC_EncA
NetC5_2: port MC_PFC_Shutdown, sheet U_MCU/MC_PFC_Shutdown
NetC6_2: port MC_PFC_Vac, sheet U_MCU/MC_PFC_Vac
NetC7_2: port MC_EmergencySTOP, sheet U_MCU2/MC_EmergencySTOP
NetC9_2: port MC_PFC_PWM, sheet U_MCU2/MC_PFC_PWM
NetC10_2: port MC_CurrentC, sheet U_MCU2/MC_CurrentC
NetC11_1: port MC_BusVoltage, sheet U_MCU2/MC_BusVoltage
NetC13_2: port MC_CurrentB, sheet U_MCU2/MC_CurrentB
NetC14_2: port MC_CurrentA, sheet U_MCU2/MC_CurrentA
NetC15_1: port USBOTG_VBUS, port USBOTG_PRDY, sheet U_LCD_Glass/USBOTG_VBUS, sheet U_LCD_Glass/USBOTG_PRDY
NetC16_2: port MC_PFC_sync, sheet U_MCU2/MC_PFC_sync
NetC17_1: port MC_Temperature, sheet U_MCU/MC_Temperature
NetC34_2: port SHIELD_CS, sheet U_MCU2/SHIELD_CS
NetC37_2: port TKEY_CS, sheet U_MCU/TKEY_CS
NetC73_1: port IDD_Measurement, sheet U_MCU/IDD_Measurement
NetCN2_3: port MC_PWM_1H, sheet U_MCU2/MC_PWM_1H
NetCN2_5: port MC_PWM_1L, sheet U_MCU/MC_PWM_1L
NetCN2_7: port MC_PWM_2H, sheet U_MCU2/MC_PWM_2H
NetCN2_9: port MC_PWM_2L, sheet U_MCU/MC_PWM_2L
NetCN2_11: port MC_PWM_3H, sheet U_MCU2/MC_PWM_3H
NetCN2_13: port MC_PWM_3L, sheet U_MCU/MC_PWM_3L
NetCN2_21: port MC_ICL_Shutout, sheet U_MCU2/MC_ICL_Shutout
NetCN2_23: port MC_DissipativeBrake, sheet U_MCU/MC_DissipativeBrake
NetCN3_4: port EXT_RESET, sheet U_IO_Expandor/EXT_RESET
NetCN11_4: port uSD_DETECT, sheet U_LCD_Glass/uSD_DETECT
NetCN11_6: port USBOTG_ID, sheet U_LCD_Glass/USBOTG_ID
NetCN11_8: port CAN_TX, sheet U_LCD_Glass/CAN_TX
NetCN11_16: port NFC_MISO, sheet U_LCD_Glass/NFC_MISO
NetCN11_18: port NFC_SCK, sheet U_LCD_Glass/NFC_SCK
NetCN11_20: port SWP_IO, sheet U_LCD_Glass/SWP_IO
NetCN11_24: port CAN_RX, sheet U_LCD_Glass/CAN_RX
NetCN11_26: port NFC_MOSI, sheet U_LCD_Glass/NFC_MOSI
NetCN11_28: port DFSDM_CKOUT, sheet U_LCD_Glass/DFSDM_CKOUT
NetCN11_30: port LED3, sheet U_LCD_Glass/LED3
NetCN11_32: port DMIC_DATIN, sheet U_LCD_Glass/DMIC_DATIN
NetCN12_12: port TRACE_CK, sheet U_MCU/TRACE_CK
NetCN12_18: port TRACE_D2, sheet U_MCU/TRACE_D2
NetCN12_20: port TRACE_D3, sheet U_MCU/TRACE_D3
NetCN14_2: port uSD_CMD, sheet U_LCD_Glass/uSD_CMD
NetCN14_10: port USART1/IrDA_RX_3V3, sheet U_LCD_Glass/USART1/IrDA_RX_3V3
NetCN14_40: port FMC_NBL0, sheet U_LCD_Glass/FMC_NBL0
NetCN14_42: port FMC_NBL1, sheet U_LCD_Glass/FMC_NBL1
NetCN18_1: port uSD_D2, sheet U_LCD_Glass/uSD_D2
NetCN18_2: port uSD_D3, sheet U_LCD_Glass/uSD_D3
NetCN18_5: port uSD_CLK, sheet U_LCD_Glass/uSD_CLK
NetCN18_7: port uSD_D0, sheet U_LCD_Glass/uSD_D0
NetCN18_8: port uSD_D1, sheet U_LCD_Glass/uSD_D1
NetCN19_31: port IOExpander_X-, sheet U_IO_Expandor/IOExpander_X-
NetCN19_32: port IOExpander_X+, sheet U_IO_Expandor/IOExpander_X+
NetCN19_33: port IOExpander_Y-, sheet U_IO_Expandor/IOExpander_Y-
NetCN19_34: port IOExpander_Y+, sheet U_IO_Expandor/IOExpander_Y+
NetD4_2: port Bootloader_RESET_3V3, sheet U_MCU2/Bootloader_RESET_3V3
NetJP19_1: port USBOTG_PPWR, sheet U_LCD_Glass/USBOTG_PPWR
NetLD6_2: port USBOTG_OVRCR, sheet U_LCD_Glass/USBOTG_OVRCR
NetR24_1: port PT100_DATIN, sheet U_LCD_Glass/PT100_DATIN
NetR32_2: port FMC_NWAIT, sheet U_MCU/FMC_NWAIT
NetR34_1: port LPUART_TX, sheet U_MCU2/LPUART_TX
NetR35_1: port CODEC_INT, sheet U_MCU2/CODEC_INT
NetR37_1: port SHIELD, sheet U_MCU2/SHIELD
NetR39_1: port TKEY, sheet U_MCU/TKEY
NetR53_2: port SAI1_SDA, sheet U_MCU/SAI1_SDA
NetR54_2: port LED1, sheet U_MCU/LED1
NetR59_2: port Bootloader_BOOT0_3V3, sheet U_MCU2/Bootloader_BOOT0_3V3
NetR71_2: port QSPI_CS, sheet U_MCU/QSPI_CS
NetR89_1: port SAI1_SCKB, sheet U_MCU2/SAI1_SCKB
NetR90_1: port SAI1_FSB, sheet U_MCU2/SAI1_FSB
NetR91_1: port IDD_CNT_EN, sheet U_MCU2/IDD_CNT_EN
NetR104_1: port TRACE_D0, sheet U_MCU/TRACE_D0
NetR105_1: port SAI1_SDB, sheet U_MCU2/SAI1_SDB
NetR106_1: port SAI1_MCKB, sheet U_MCU2/SAI1_MCKB
NetR107_1: port SmartCard_CLK, sheet U_LCD_Glass/SmartCard_CLK
NetR137_1: port IDD_WAKEUP, sheet U_LCD_Glass/IDD_WAKEUP
NetR143_1: port SmartCard_IO, sheet U_LCD_Glass/SmartCard_IO
NetR156_2: port TRACE_D1, sheet U_MCU/TRACE_D1
NetR213_1: port SmartCard_OFF, sheet U_IO_Expandor/SmartCard_OFF
NetR214_2: port SmartCard_RST, sheet U_IO_Expandor/SmartCard_RST
NetR215_2: port SmartCard_CMDVCC, sheet U_IO_Expandor/SmartCard_CMDVCC
NetR241_1: port SmartCard_3/5V, sheet U_IO_Expandor/SmartCard_3/5V
NetR255_1: port LED4, sheet U_IO_Expandor/LED4
NetR257_1: port LED2, sheet U_IO_Expandor/LED2
NetR260_1: port BL_Control, sheet U_IO_Expandor/BL_Control
NetR263_2: port I2C2_SDA, sheet U_LCD_Glass/I2C2_SDA
NetR264_2: port I2C2_SCL, sheet U_LCD_Glass/I2C2_SCL
NetSB9_1: port QSPI_CLK, sheet U_MCU/QSPI_CLK
NetSB12_1: port QSPI_D0, sheet U_MCU/QSPI_D0
NetSB14_1: port QSPI_D1, sheet U_MCU/QSPI_D1
NetSB18_1: port QSPI_D2, sheet U_MCU/QSPI_D2
NetSB21_1: port QSPI_D3, sheet U_MCU/QSPI_D3

### Buses and harness runs
bus A[0..15] = sheet U_MCU2/A[0..15]
bus A[0..23] = port A[0..23]
bus A[16..19] = sheet U_LCD_Glass/A[16..19]
bus A[20..22] = sheet U_MCU/A[20..22]
bus D[0..15] = port D[0..15]
bus D[0..15] = sheet U_LCD_Glass/D[0..15]
bus D[0..15] = sheet U_MCU2/D[0..15]
bus D[0..15] = sheet U_MCU/D[0..15]
bus LCDCOM[0..3] = sheet U_MCU/LCDCOM[0..3]
bus LCDCOM[0..7] = sheet U_LCD_Glass/LCDCOM[0..7]
bus LCDCOM[4..6] = sheet U_MCU2/LCDCOM[4..6]
bus LCDSEG[0..17] = sheet U_MCU/LCDSEG[0..17]
bus LCDSEG[0..39] = sheet U_LCD_Glass/LCDSEG[0..39]
bus LCDSEG[18..20] = sheet U_MCU2/LCDSEG[18..20]
bus LCDSEG[22..27] = sheet U_MCU2/LCDSEG[22..27]
bus LCDSEG[28..39] = sheet U_MCU/LCDSEG[28..39]
bus port PA[0..15] = sheet U_MCU/PA[0..15]
bus port PB[0..15] = sheet U_MCU/PB[0..15]
bus port PC[0..15] = sheet U_MCU2/PC[0..15]
bus port PD[0..15] = sheet U_MCU/PD[0..15]
bus port PE[0..15] = sheet U_MCU/PE[0..15]
bus port PF[0..15] = sheet U_MCU2/PF[0..15]
bus port PG[0..15] = sheet U_MCU2/PG[0..15]

### Notes on the sheet
- Title:
- Project:
- Size:
- Date:
- A3
- Reference:
- Sheet:
- Revision:
- of

## Sheet MCU.SchDoc: MCU
size A3; DocumentNumber: MB1144; Revision: C-02; SheetNumber: 3; SheetTotal: 25; PageSetup: Record=PageOptions|CenterHorizontal=True|CenterVertical=True|PrintScale=1.04|XCorrection=1.00|YCorrection=1.00|PrintKind=1|BorderSize=5000000|LeftOffset=0|BottomOffset=0|Orientation=2|PaperLength=1000|PaperWidth=1000|Scale=100|PaperSource=7|PrintQuality=600|MediaType=1|DitherType=10|PaperKind=A3|PrintScaleMode=1; Project: STM32L476G-EVAL; ModifiedDate: 9/23/2015
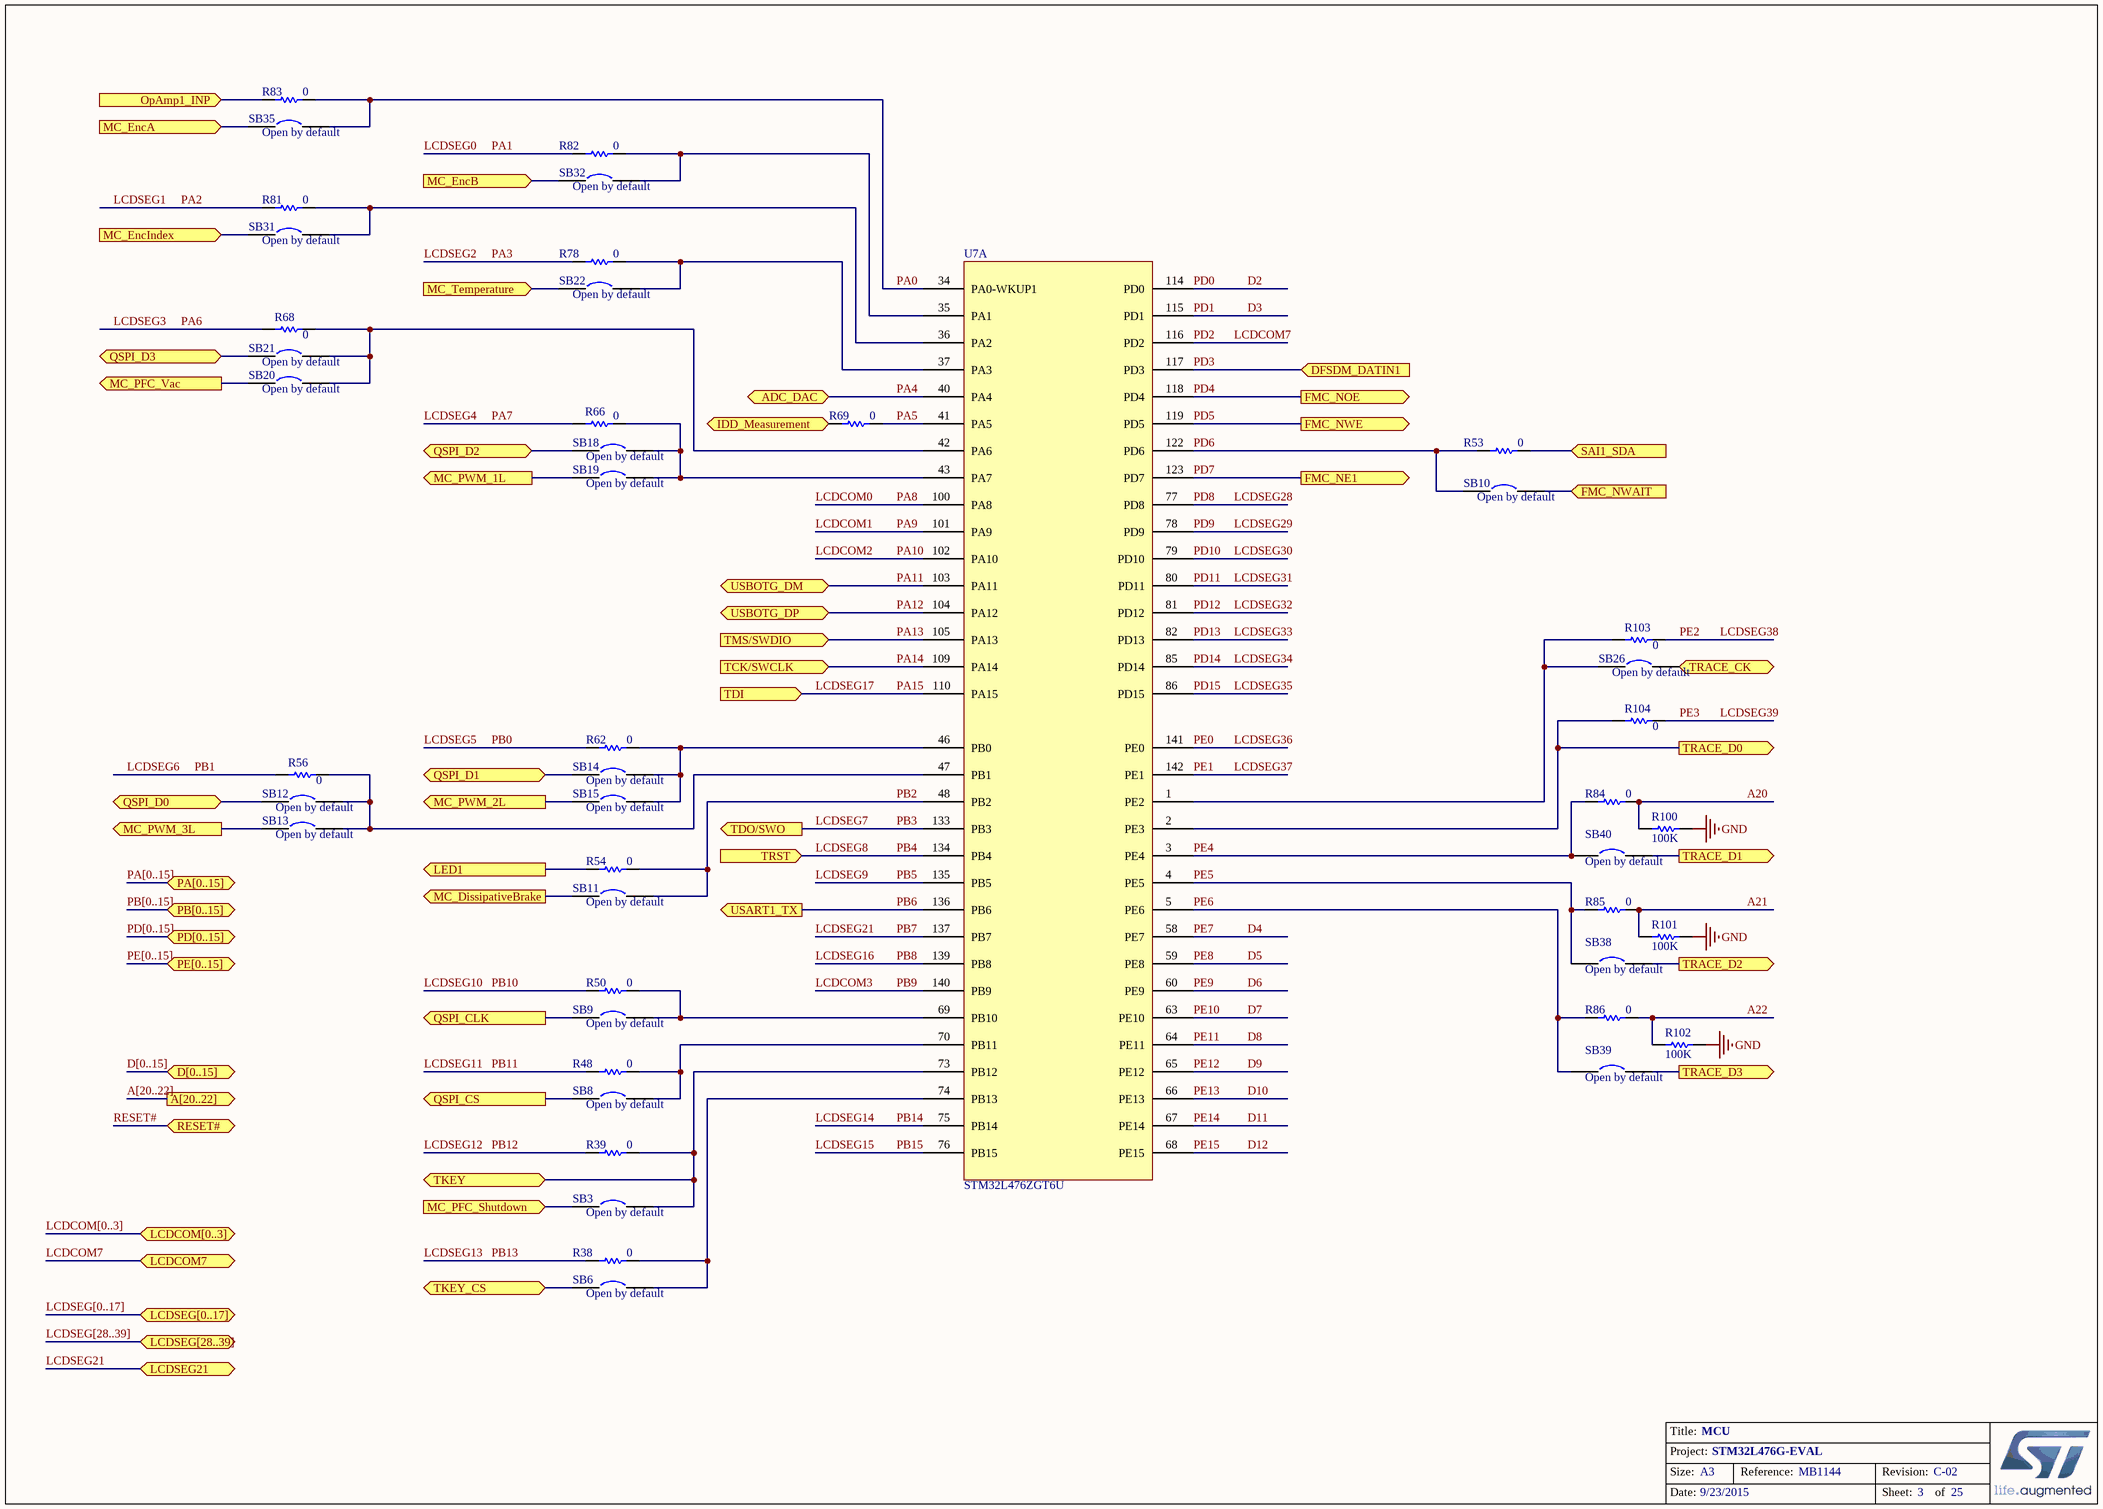
[diagram p2: MCU.SchDoc]

### Parts
R38  0  [SB_0603]
R39  0  [SB_0603]
R48  0  [SB_0603]
R50  0  [SB_0603]
R53  0  [SB_0603]
R54  0  [SB_0603]
R56  0  [SB_0603]
R62  0  [SB_0603]
R66  0  [SB_0603]
R68  0  [SB_0603]
R69  0  [0603R]
R78  0  [SB_0603]
R81  0  [SB_0603]
R82  0  [SB_0603]
R83  0  [SB_0603]
R84  0  [SB_0603]
R85  0  [SB_0603]
R86  0  [SB_0603]
R100  100K  [0402R]
R101  100K  [0402R]
R102  100K  [0402R]
R103  0  [SB_0603]
R104  0  [SB_0603]
SB3  Open by default  [SB_0603]
SB6  Open by default  [SB_0603]
SB8  Open by default  [SB_0603]
SB9  Open by default  [SB_0603]
SB10  Open by default  [SB_0603]
SB11  Open by default  [SB_0603]
SB12  Open by default  [SB_0603]
SB13  Open by default  [SB_0603]
SB14  Open by default  [SB_0603]
SB15  Open by default  [SB_0603]
SB18  Open by default  [SB_0603]
SB19  Open by default  [SB_0603]
SB20  Open by default  [SB_0603]
SB21  Open by default  [SB_0603]
SB22  Open by default  [SB_0603]
SB26  Open by default  [SB_0603]
SB31  Open by default  [SB_0603]
SB32  Open by default  [SB_0603]
SB35  Open by default  [SB_0603]
SB38  Open by default  [SB_0603]
SB39  Open by default  [SB_0603]
SB40  Open by default  [SB_0603]
U7  STM32L476ZGT6U  [TQFP144_0R5_22X22_SOCKET]  (part A of 3)

### Ports
A[20..22] (out), ADC_DAC (bidir), D[0..15] (bidir), DFSDM_DATIN1 (in), FMC_NE1 (out), FMC_NOE (out), FMC_NWAIT (in), FMC_NWE (out), IDD_Measurement (in), LCDCOM7, LCDCOM[0..3] (bidir), LCDSEG21 (bidir), LCDSEG[0..17] (bidir), LCDSEG[28..39] (bidir), LED1 (out), MC_DissipativeBrake (out), MC_EncA (in), MC_EncB (in), MC_EncIndex (in), MC_PFC_Shutdown (in), MC_PFC_Vac (out), MC_PWM_1L (out), MC_PWM_2L (out), MC_PWM_3L (out), MC_Temperature (in), OpAmp1_INP (in), PA[0..15] (bidir), PB[0..15] (bidir), PD[0..15] (bidir), PE[0..15] (bidir), QSPI_CLK (out), QSPI_CS (out), QSPI_D0 (bidir), QSPI_D1 (bidir), QSPI_D2 (bidir), QSPI_D3 (bidir), RESET# (bidir), SAI1_SDA (in), TCK/SWCLK (in), TDI (in), TDO/SWO (out), TKEY, TKEY_CS, TMS/SWDIO (in), TRACE_CK (out), TRACE_D0 (out), TRACE_D1 (out), TRACE_D2 (out), TRACE_D3 (out), TRST (in), USART1_TX (out), USBOTG_DM (bidir), USBOTG_DP (bidir)

### Nets
GND: R100.2 R101.2 R102.2
A20: R84.1 R100.1
A21: R85.1 R101.1
A22: R86.1 R102.1
D2: U7.114(PD0)  [also labelled PD0]
D3: U7.115(PD1)  [also labelled PD1]
D4: U7.58(PE7)  [also labelled PE7]
D5: U7.59(PE8)  [also labelled PE8]
D6: U7.60(PE9)  [also labelled PE9]
D7: U7.63(PE10)  [also labelled PE10]
D8: U7.64(PE11)  [also labelled PE11]
D9: U7.65(PE12)  [also labelled PE12]
D10: U7.66(PE13)  [also labelled PE13]
D11: U7.67(PE14)  [also labelled PE14]
D12: U7.68(PE15)  [also labelled PE15]
LCDCOM0: U7.100(PA8)  [also labelled PA8]
LCDCOM1: U7.101(PA9)  [also labelled PA9]
LCDCOM2: U7.102(PA10)  [also labelled PA10]
LCDCOM3: U7.140(PB9)  [also labelled PB9]
LCDCOM7: U7.116(PD2) ; port LCDCOM7  [also labelled PD2]
LCDSEG0: R82.1  [also labelled PA1]
LCDSEG1: R81.1  [also labelled PA2]
LCDSEG2: R78.2  [also labelled PA3]
LCDSEG3: R68.1  [also labelled PA6]
LCDSEG4: R66.1  [also labelled PA7]
LCDSEG5: R62.1  [also labelled PB0]
LCDSEG6: R56.1  [also labelled PB1]
LCDSEG7: U7.133(PB3) ; port TDO/SWO  [also labelled PB3]
LCDSEG8: U7.134(PB4) ; port TRST  [also labelled PB4]
LCDSEG9: U7.135(PB5)  [also labelled PB5]
LCDSEG10: R50.1  [also labelled PB10]
LCDSEG11: R48.1  [also labelled PB11]
LCDSEG12: R39.2  [also labelled PB12]
LCDSEG13: R38.1  [also labelled PB13]
LCDSEG14: U7.75(PB14)  [also labelled PB14]
LCDSEG15: U7.76(PB15)  [also labelled PB15]
LCDSEG16: U7.139(PB8)  [also labelled PB8]
LCDSEG17: U7.110(PA15) ; port TDI  [also labelled PA15]
LCDSEG21: U7.137(PB7) ; port LCDSEG21  [also labelled PB7]
LCDSEG28: U7.77(PD8)  [also labelled PD8]
LCDSEG29: U7.78(PD9)  [also labelled PD9]
LCDSEG30: U7.79(PD10)  [also labelled PD10]
LCDSEG31: U7.80(PD11)  [also labelled PD11]
LCDSEG32: U7.81(PD12)  [also labelled PD12]
LCDSEG33: U7.82(PD13)  [also labelled PD13]
LCDSEG34: U7.85(PD14)  [also labelled PD14]
LCDSEG35: U7.86(PD15)  [also labelled PD15]
LCDSEG36: U7.141(PE0)  [also labelled PE0]
LCDSEG37: U7.142(PE1)  [also labelled PE1]
LCDSEG38: R103.2  [also labelled PE2]
LCDSEG39: R104.2  [also labelled PE3]
OpAmp1_INP: R83.2 ; port OpAmp1_INP
PA0: R83.1 SB35.2 U7.34(PA0-WKUP1)
PA4: U7.40(PA4) ; port ADC_DAC
PA5: R69.1 U7.41(PA5)
PA11: U7.103(PA11) ; port USBOTG_DM
PA12: U7.104(PA12) ; port USBOTG_DP
PA13: U7.105(PA13) ; port TMS/SWDIO
PA14: U7.109(PA14) ; port TCK/SWCLK
PB2: R54.1 SB11.2 U7.48(PB2)
PB6: U7.136(PB6) ; port USART1_TX
PD3: U7.117(PD3) ; port DFSDM_DATIN1
PD4: U7.118(PD4) ; port FMC_NOE
PD5: U7.119(PD5) ; port FMC_NWE
PD6: R53.1 SB10.1 U7.122(PD6)
PD7: U7.123(PD7) ; port FMC_NE1
PE4: R84.2 SB40.1 U7.3(PE4)
PE5: R85.2 SB38.1 U7.4(PE5)
PE6: R86.2 SB39.1 U7.5(PE6)
NetC1_2: SB32.1 ; port MC_EncB
NetC2_2: SB31.1 ; port MC_EncIndex
NetC4_2: SB35.1 ; port MC_EncA
NetC5_2: SB3.1 ; port MC_PFC_Shutdown
NetC6_2: SB20.1 ; port MC_PFC_Vac
NetC17_1: SB22.1 ; port MC_Temperature
NetC37_2: SB6.1 ; port TKEY_CS
NetC73_1: R69.2 ; port IDD_Measurement
NetCN2_5: SB19.1 ; port MC_PWM_1L
NetCN2_9: SB15.1 ; port MC_PWM_2L
NetCN2_13: SB13.1 ; port MC_PWM_3L
NetCN2_23: SB11.1 ; port MC_DissipativeBrake
NetCN12_12: SB26.2 ; port TRACE_CK
NetCN12_18: SB38.2 ; port TRACE_D2
NetCN12_20: SB39.2 ; port TRACE_D3
NetR32_2: SB10.2 ; port FMC_NWAIT
NetR38_2: R38.2 SB6.2 U7.74(PB13)
NetR39_1: R39.1 SB3.2 U7.73(PB12) ; port TKEY
NetR48_2: R48.2 SB8.2 U7.70(PB11)
NetR50_2: R50.2 SB9.2 U7.69(PB10)
NetR53_2: R53.2 ; port SAI1_SDA
NetR54_2: R54.2 ; port LED1
NetR56_2: R56.2 SB12.2 SB13.2 U7.47(PB1)
NetR62_2: R62.2 SB14.2 SB15.2 U7.46(PB0)
NetR66_2: R66.2 SB18.2 SB19.2 U7.43(PA7)
NetR68_2: R68.2 SB20.2 SB21.2 U7.42(PA6)
NetR71_2: SB8.1 ; port QSPI_CS
NetR78_1: R78.1 SB22.2 U7.37(PA3)
NetR81_2: R81.2 SB31.2 U7.36(PA2)
NetR82_2: R82.2 SB32.2 U7.35(PA1)
NetR103_1: R103.1 SB26.1 U7.1(PE2)
NetR104_1: R104.1 U7.2(PE3) ; port TRACE_D0
NetR156_2: SB40.2 ; port TRACE_D1
NetSB9_1: SB9.1 ; port QSPI_CLK
NetSB12_1: SB12.1 ; port QSPI_D0
NetSB14_1: SB14.1 ; port QSPI_D1
NetSB18_1: SB18.1 ; port QSPI_D2
NetSB21_1: SB21.1 ; port QSPI_D3

### Buses and harness runs
bus A[20..22] = port A[20..22]
bus D[0..15] = port D[0..15]
bus LCDCOM[0..3] = port LCDCOM[0..3]
bus LCDSEG[0..17] = port LCDSEG[0..17]
bus LCDSEG[28..39] = port LCDSEG[28..39]
bus PA[0..15] = port PA[0..15]
bus PB[0..15] = port PB[0..15]
bus PD[0..15] = port PD[0..15]
bus PE[0..15] = port PE[0..15]

### Notes on the sheet
- Title:
- Project:
- Size:
- Date:
- A3
- Reference:
- Sheet:
- Revision:
- of

### Library data of the parts
R38 R48 R50 R53 R56 R62 R66 R68 R81 R82 R103 R104 = Res1: Resistor; Value: 1K; Ordered by: Subcon; ECCN_US/EU: NA; Published: 8-Jun-2000; Revision: July-2002: Re-released for DXP Platform.; Publisher: Altium Limited
R39 R54 R69 R78 R83-R86 R100-R102 = res1: Resistor; Value: 1K; Ordered by: Subcon; ECCN_US/EU: NA; Published: 8-Jun-2000; Revision: July-2002: Re-released for DXP Platform.; Publisher: Altium Limited
SB3 SB6 SB8-SB15 SB18-SB22 SB26 SB31 SB32 SB35 SB38-SB40 = Circuit Breaker: Ordered by: Subcon; Comments: Solder bridge; Fitted: NO; ECCN_US/EU: NA; Published: 24-Mar-1999; Revision: July-2002: Re-released for DXP Platform.; Publisher: Altium Limited
U7 = STM32L476_TQFP144: Manuf_Part_1: STM32L476ZGT6U cut1.3; Ordered by: ST; ECCN_US/EU: 3A991A2/NEC; Assembly: MCU; Ref St: 9175195; Manuf_1: ST

## Sheet LCD_Glass.SchDoc: LCD_Glass
size A3; DocumentNumber: MB1144; Revision: C-02; SheetNumber: 5; SheetTotal: 25; PageSetup: Record=PageOptions|CenterHorizontal=True|CenterVertical=True|PrintScale=1.04|XCorrection=1.00|YCorrection=1.00|PrintKind=1|BorderSize=5000000|LeftOffset=0|BottomOffset=0|Orientation=2|PaperLength=1000|PaperWidth=1000|Scale=100|PaperSource=7|PrintQuality=600|MediaType=1|DitherType=10|PaperKind=A3|PrintScaleMode=1; Project: STM32L476G-EVAL; ModifiedDate: 9/23/2015
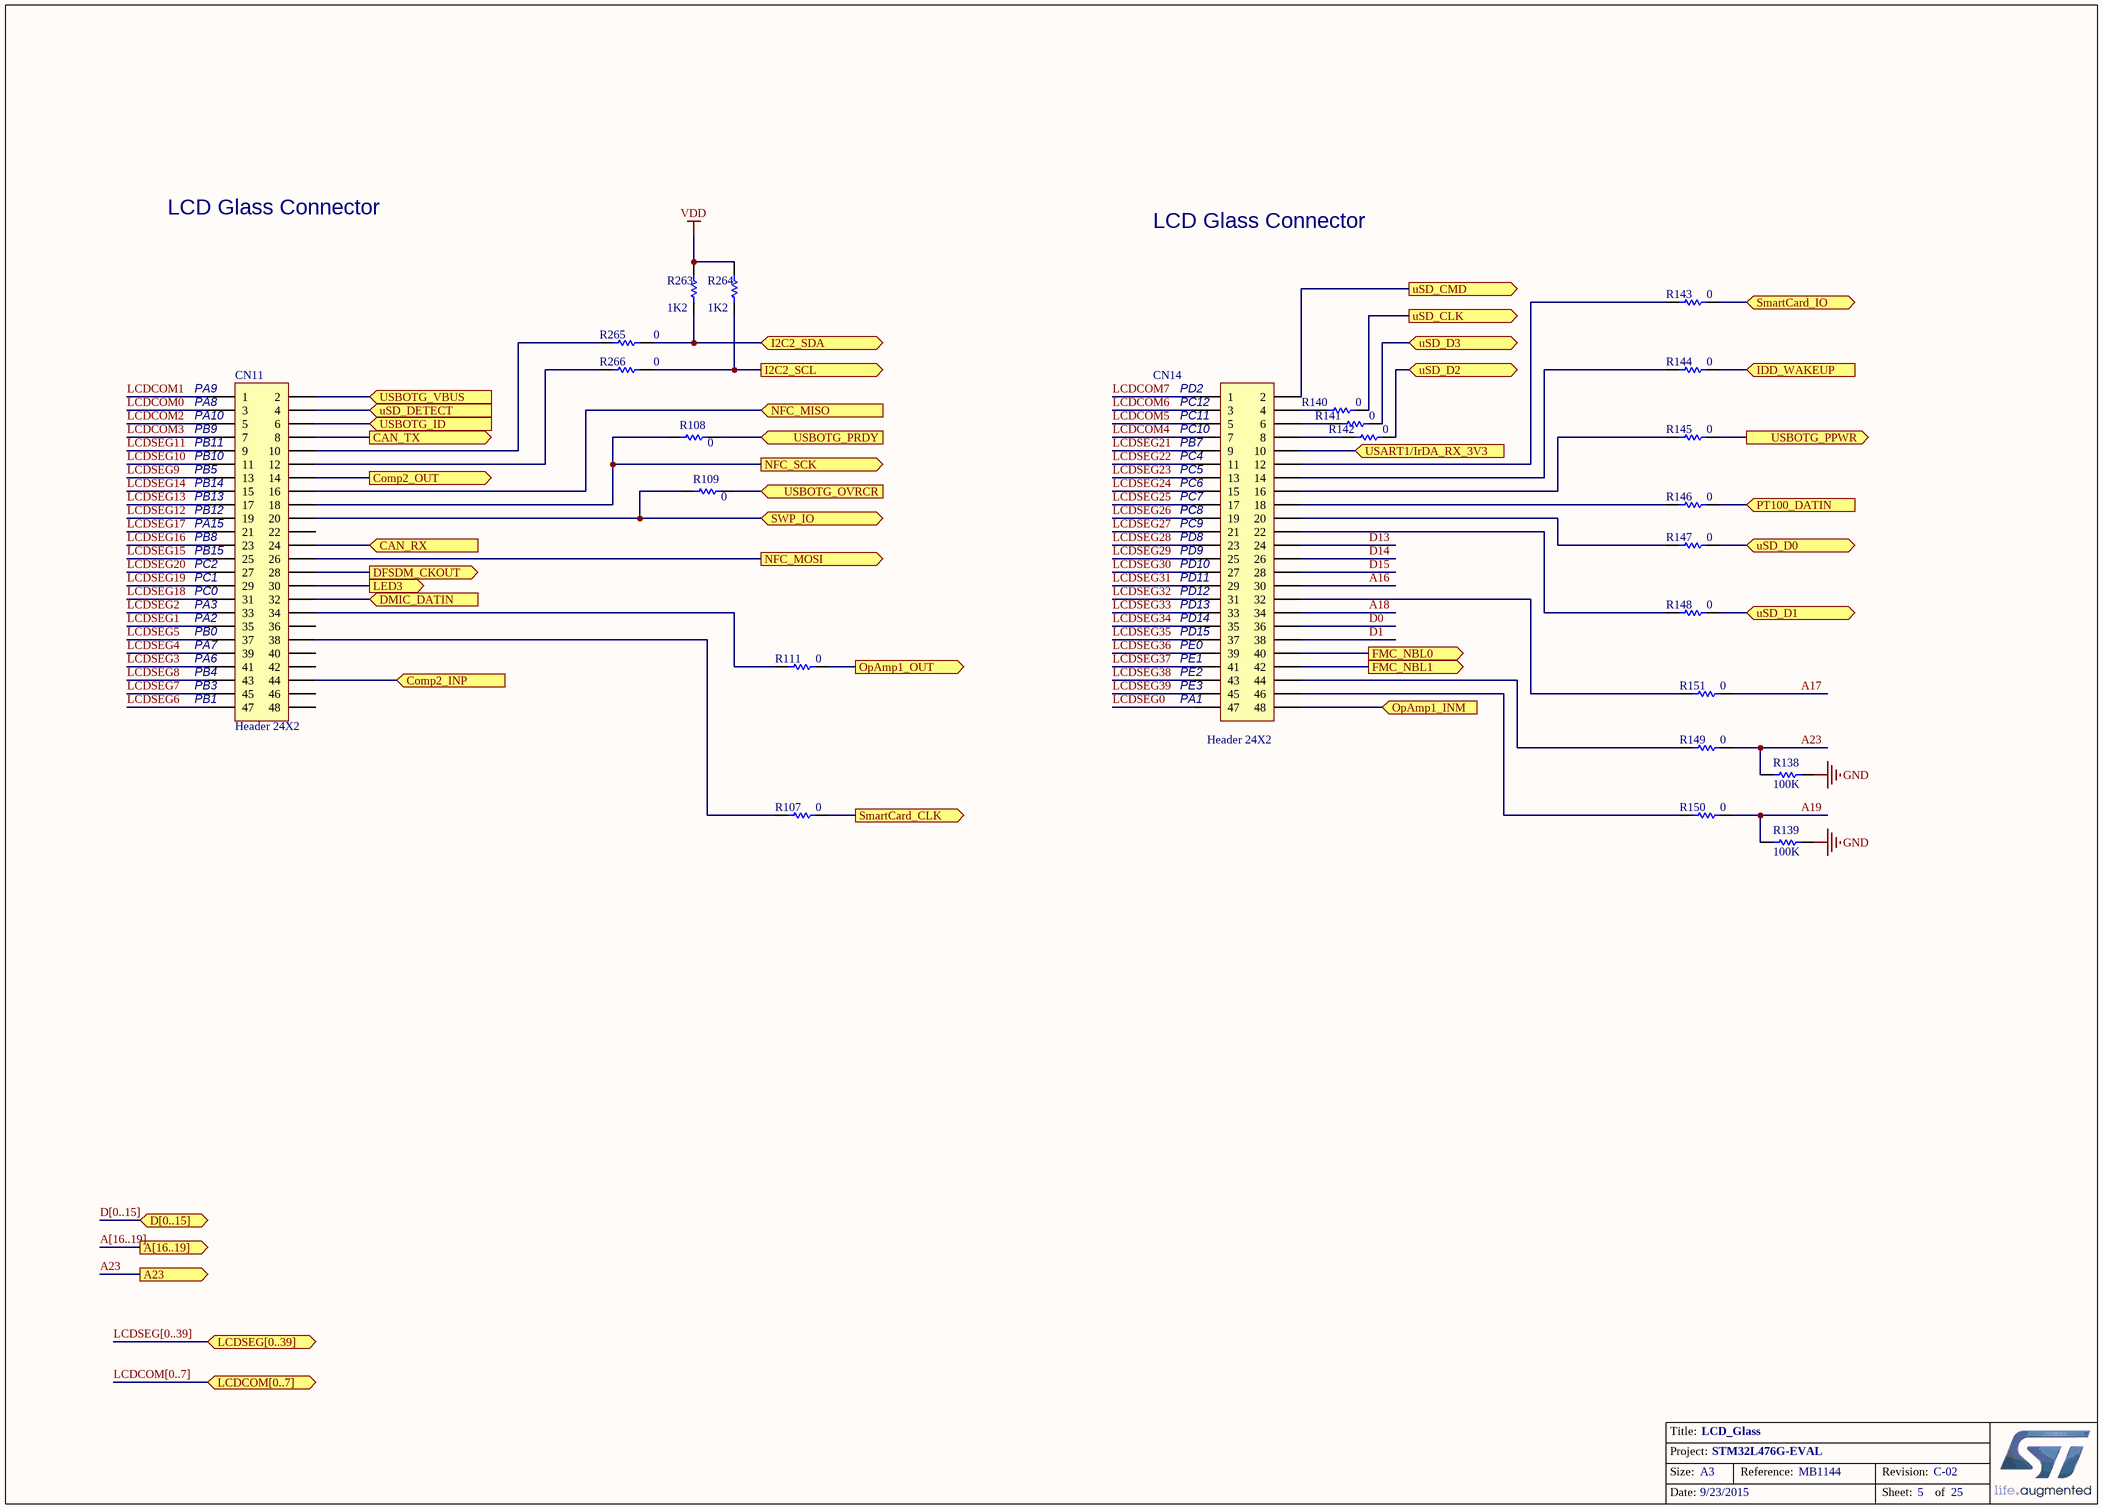
[diagram p3: LCD_Glass.SchDoc]

### Parts
CN11  Header 24X2  [HDR_2X24_2R54]
CN14  Header 24X2  [HDR_2X24_2R54]
R107  0  [0603R]
R108  0  [SB_0603]
R109  0  [SB_0603]
R111  0  [0603R]
R138  100K  [0402R]
R139  100K  [0402R]
R140  0  [0603R]
R141  0  [0603R]
R142  0  [0603R]
R143  0  [0603R]
R144  0  [0603R]
R145  0  [0603R]
R146  0  [0603R]
R147  0  [0603R]
R148  0  [0603R]
R149  0  [0603R]
R150  0  [0603R]
R151  0  [0603R]
R263  1K2  [0402R]
R264  1K2  [0402R]
R265  0  [0603R]
R266  0  [0603R]

### Ports
A23 (out), A[16..19] (out), CAN_RX (in), CAN_TX (out), Comp2_INP (in), Comp2_OUT (out), D[0..15] (bidir), DFSDM_CKOUT (out), DMIC_DATIN (in), FMC_NBL0 (out), FMC_NBL1 (out), I2C2_SCL (out), I2C2_SDA (bidir), IDD_WAKEUP (in), LCDCOM[0..7] (bidir), LCDSEG[0..39] (bidir), LED3 (out), NFC_MISO (in), NFC_MOSI (out), NFC_SCK (out), OpAmp1_INM (in), OpAmp1_OUT (out), PT100_DATIN (in), SmartCard_CLK (out), SmartCard_IO (bidir), SWP_IO (bidir), USART1/IrDA_RX_3V3 (in), USBOTG_ID (in), USBOTG_OVRCR (in), USBOTG_PPWR (out), USBOTG_PRDY (in), USBOTG_VBUS (in), uSD_CLK (out), uSD_CMD (out), uSD_D0 (bidir), uSD_D1 (bidir), uSD_D2 (bidir), uSD_D3 (bidir), uSD_DETECT (in)

### Nets
GND: R138.2 R139.2
VDD: R263.1 R264.1
A16: CN14.30
A17: R151.1
A18: CN14.34
A19: R139.1 R150.1
A23: R138.1 R149.1 ; port A23
Comp2_INP: CN11.44 ; port Comp2_INP
Comp2_OUT: CN11.14 ; port Comp2_OUT
D0: CN14.36
D1: CN14.38
D13: CN14.24
D14: CN14.26
D15: CN14.28
LCDCOM0: CN11.3
LCDCOM1: CN11.1
LCDCOM2: CN11.5
LCDCOM3: CN11.7
LCDCOM4: CN14.7
LCDCOM5: CN14.5
LCDCOM6: CN14.3
LCDCOM7: CN14.1
LCDSEG0: CN14.47
LCDSEG1: CN11.35
LCDSEG2: CN11.33
LCDSEG3: CN11.41
LCDSEG4: CN11.39
LCDSEG5: CN11.37
LCDSEG6: CN11.47
LCDSEG7: CN11.45
LCDSEG8: CN11.43
LCDSEG9: CN11.13
LCDSEG10: CN11.11
LCDSEG11: CN11.9
LCDSEG12: CN11.19
LCDSEG13: CN11.17
LCDSEG14: CN11.15
LCDSEG15: CN11.25
LCDSEG16: CN11.23
LCDSEG17: CN11.21
LCDSEG18: CN11.31
LCDSEG19: CN11.29
LCDSEG20: CN11.27
LCDSEG21: CN14.9
LCDSEG22: CN14.11
LCDSEG23: CN14.13
LCDSEG24: CN14.15
LCDSEG25: CN14.17
LCDSEG26: CN14.19
LCDSEG27: CN14.21
LCDSEG28: CN14.23
LCDSEG29: CN14.25
LCDSEG30: CN14.27
LCDSEG31: CN14.29
LCDSEG32: CN14.31
LCDSEG33: CN14.33
LCDSEG34: CN14.35
LCDSEG35: CN14.37
LCDSEG36: CN14.39
LCDSEG37: CN14.41
LCDSEG38: CN14.43
LCDSEG39: CN14.45
OpAmp1_INM: CN14.48 ; port OpAmp1_INM
OpAmp1_OUT: R111.1 ; port OpAmp1_OUT
NetC15_1: CN11.2 R108.2 ; port USBOTG_VBUS, port USBOTG_PRDY
NetCN11_4: CN11.4 ; port uSD_DETECT
NetCN11_6: CN11.6 ; port USBOTG_ID
NetCN11_8: CN11.8 ; port CAN_TX
NetCN11_10: CN11.10 R265.2
NetCN11_12: CN11.12 R266.2
NetCN11_16: CN11.16 ; port NFC_MISO
NetCN11_18: CN11.18 R108.1 ; port NFC_SCK
NetCN11_20: CN11.20 R109.1 ; port SWP_IO
NetCN11_24: CN11.24 ; port CAN_RX
NetCN11_26: CN11.26 ; port NFC_MOSI
NetCN11_28: CN11.28 ; port DFSDM_CKOUT
NetCN11_30: CN11.30 ; port LED3
NetCN11_32: CN11.32 ; port DMIC_DATIN
NetCN11_34: CN11.34 R111.2
NetCN11_38: CN11.38 R107.2
NetCN14_2: CN14.2 ; port uSD_CMD
NetCN14_4: CN14.4 R140.2
NetCN14_6: CN14.6 R141.2
NetCN14_8: CN14.8 R142.2
NetCN14_10: CN14.10 ; port USART1/IrDA_RX_3V3
NetCN14_12: CN14.12 R143.2
NetCN14_14: CN14.14 R144.2
NetCN14_16: CN14.16 R145.2
NetCN14_18: CN14.18 R146.2
NetCN14_20: CN14.20 R147.2
NetCN14_22: CN14.22 R148.2
NetCN14_32: CN14.32 R151.2
NetCN14_40: CN14.40 ; port FMC_NBL0
NetCN14_42: CN14.42 ; port FMC_NBL1
NetCN14_44: CN14.44 R149.2
NetCN14_46: CN14.46 R150.2
NetCN18_1: R142.1 ; port uSD_D2
NetCN18_2: R141.1 ; port uSD_D3
NetCN18_5: R140.1 ; port uSD_CLK
NetCN18_7: R147.1 ; port uSD_D0
NetCN18_8: R148.1 ; port uSD_D1
NetJP19_1: R145.1 ; port USBOTG_PPWR
NetLD6_2: R109.2 ; port USBOTG_OVRCR
NetR24_1: R146.1 ; port PT100_DATIN
NetR107_1: R107.1 ; port SmartCard_CLK
NetR137_1: R144.1 ; port IDD_WAKEUP
NetR143_1: R143.1 ; port SmartCard_IO
NetR263_2: R263.2 R265.1 ; port I2C2_SDA
NetR264_2: R264.2 R266.1 ; port I2C2_SCL

Not connected (* = marked no-connect by the designer): CN11 22 36 40 42 46 48

### Buses and harness runs
bus A[16..19] = port A[16..19]
bus D[0..15] = port D[0..15]
bus LCDCOM[0..7] = port LCDCOM[0..7]
bus LCDSEG[0..39] = port LCDSEG[0..39]

### Notes on the sheet
- LCD Glass Connector
- (near CN11) PA9
- (near CN11) PA8
- (near CN11) PA10
- (near CN11) PB9
- (near CN11) PB11
- (near CN14) PD2
- (near CN14) PC12
- (near CN14) PC11
- (near CN14) PC10
- (near CN14) PB7
- (near CN11) PB10
- (near CN11) PB5
- (near CN11) PB14
- (near CN11) PB13
- (near CN11) PB12
- (near CN14) PC4
- (near CN14) PC5
- (near CN14) PC6
- (near CN14) PC7
- (near CN14) PC
- (near CN14) PC8
- (near CN11) PA15
- (near CN11) PB8
- (near CN11) PB15
- (near CN11) PC2
- (near CN11) PC1
- (near CN14) PD11
- (near CN14) PD10
- (near CN14) PD9
- (near CN14) PD8
- (near CN14) PC9
- (near CN11) PA3
- (near CN11) PA2
- (near CN11) PA7
- (near CN11) PB0
- (near CN11) PC0
- (near CN14) PD12
- (near CN14) PD13
- (near CN14) PD14
- (near CN14) PD15
- (near CN14) PE0
- (near CN11) PA6
- (near CN11) PB4
- (near CN11) PB3
- (near CN11) PB1
- (near CN14) PE1
- (near CN14) PE2
- (near CN14) PE3
- (near CN14) PA1
- Title:
- Project:
- Size:
- Date:
- A3
- Reference:
- Sheet:
- Revision:
- of

### Library data of the parts
CN11 CN14 = Header 24X2: Header, 24-Pin, Dual row; Ordered by: Subcon; Comments: LCD Glass connector; ECCN_US/EU: NA; Assembly: with MB979; Revision: 17-Jul-2002: Re-released for DXP Platform.; Publisher: Altium Limited
R107 R111 R138-R151 = res1: as R39 on sheet MCU; Published: 8-Jun-2000; Revision: July-2002: Re-released for DXP Platform.; Publisher: Altium Limited
R108 R109 R263-R266 = Res1: as R38 on sheet MCU; Published: 8-Jun-2000; Revision: July-2002: Re-released for DXP Platform.; Publisher: Altium Limited